# EasyEDA Pro project ESP32_RelayBoard.eprj

# Schematic ESP32_RelayControl
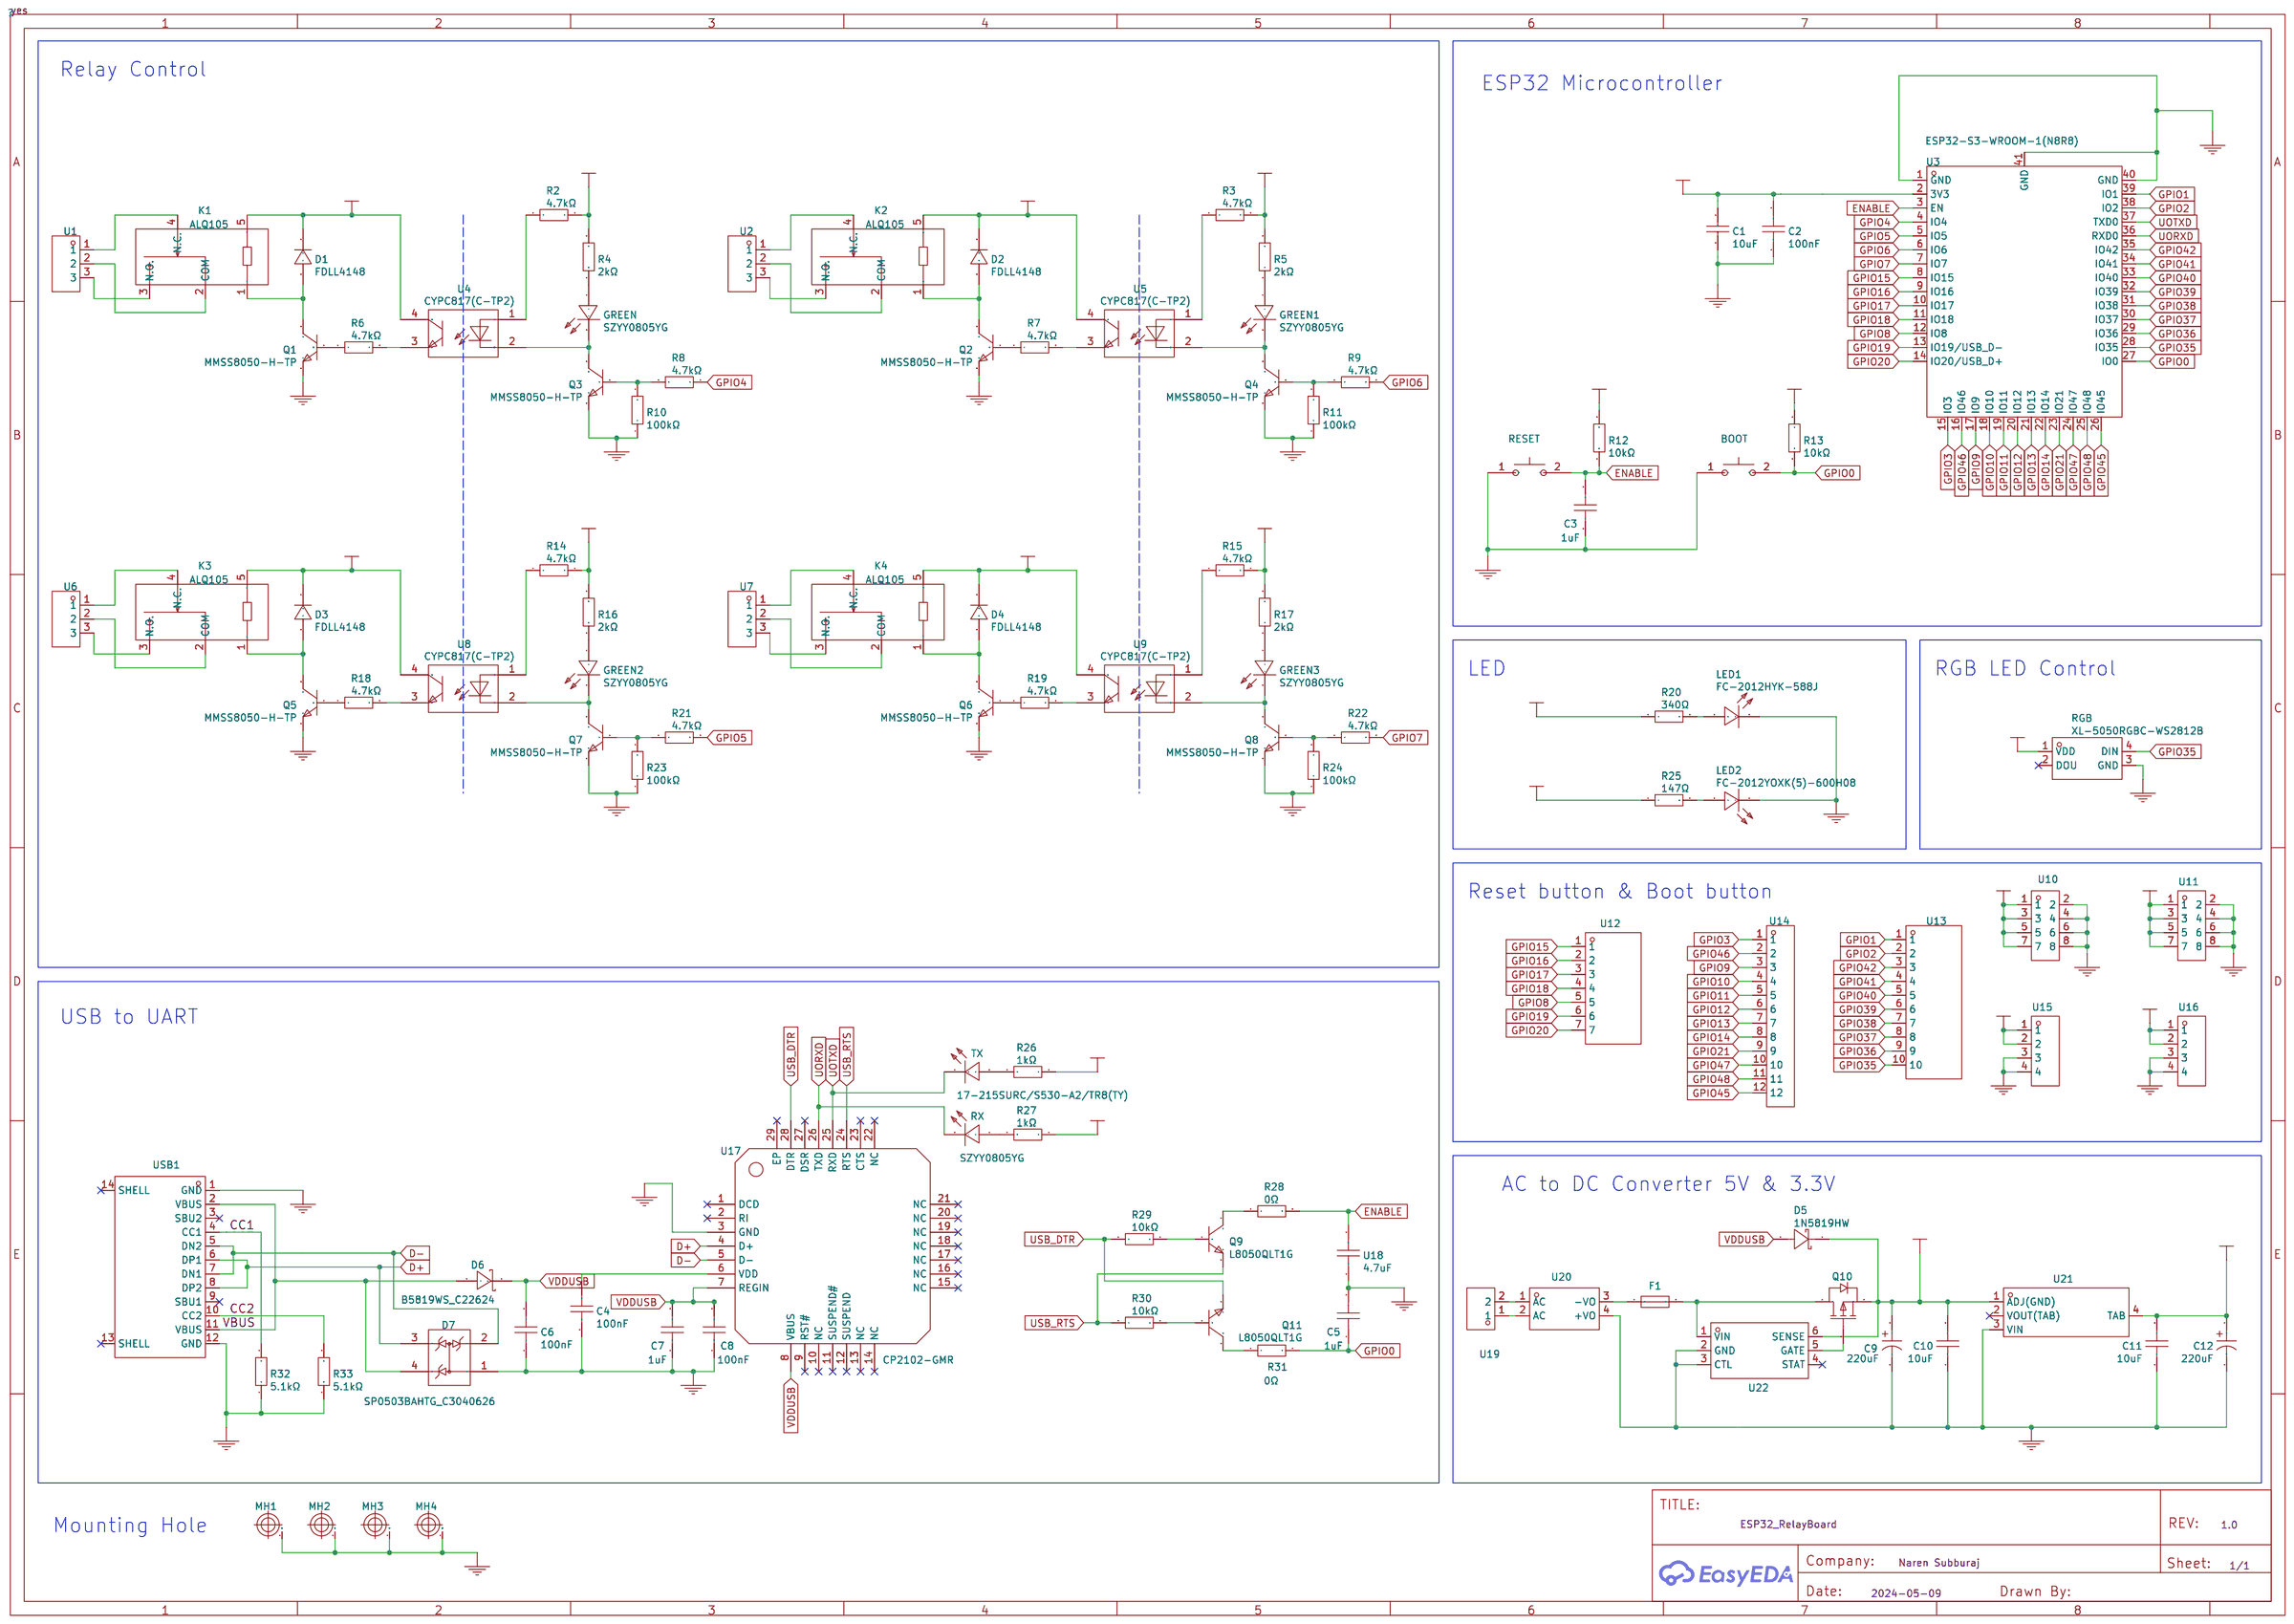
[diagram p0: schematic sheet]

## Parts
BOOT  TS-1101S-C-B-B-B-A  [SW-SMD_L6.0-W3.5-LS8.0]
C1  10uF  [C0402]
C2  100nF  [C0402]
C3  1uF  [C0402]
C4  100nF  [C0402]
C5  1uF  [C0402]
C6  100nF  [C0402]
C7  1uF  [C0402]
C8  100nF  [C0402]
C9  220uF  [CAP-SMD_BD6.3-L6.6-W6.6-LS7.2-FD]
C10  10uF  [C0805]
C11  10uF  [C0805]
C12  220uF  [CAP-SMD_BD6.3-L6.6-W6.6-LS7.2-FD]
D1  FDLL4148  [SOD-80_L3.5-W1.5-RD]
D2  FDLL4148  [SOD-80_L3.5-W1.5-RD]
D3  FDLL4148  [SOD-80_L3.5-W1.5-RD]
D4  FDLL4148  [SOD-80_L3.5-W1.5-RD]
D5  1N5819HW  [SOD-123_L2.7-W1.6-LS3.7-RD-1]
D6  B5819WS_C22624  [SOD-323_L1.8-W1.3-LS2.5-RD]
D7  SP0503BAHTG_C3040626  [SOT-143-4_L2.9-W1.3-P1.92-LS2.4-BL]
F1  BSMD0805-100-6V  [F0805]
GREEN  SZYY0805YG  [LED0805-R-RD_GREEN]
GREEN1  SZYY0805YG  [LED0805-R-RD_GREEN]
GREEN2  SZYY0805YG  [LED0805-R-RD_GREEN]
GREEN3  SZYY0805YG  [LED0805-R-RD_GREEN]
K1  ALQ105  [RELAY-TH_ALQ1XX]
K2  ALQ105  [RELAY-TH_ALQ1XX]
K3  ALQ105  [RELAY-TH_ALQ1XX]
K4  ALQ105  [RELAY-TH_ALQ1XX]
LED1  FC-2012HYK-588J  [LED0805-R-RD]
LED2  FC-2012YOXK(5)-600H08  [LED0805-RD_ORANGE]
MH1  M2-MOUNTING-HOLE  [M2-MOUNTING-HOLE]
MH2  M2-MOUNTING-HOLE  [M2-MOUNTING-HOLE]
MH3  M2-MOUNTING-HOLE  [M2-MOUNTING-HOLE]
MH4  M2-MOUNTING-HOLE  [M2-MOUNTING-HOLE]
Q1  MMSS8050-H-TP  [SOT-23-3_L2.9-W1.6-P1.90-LS2.8-BR]
Q2  MMSS8050-H-TP  [SOT-23-3_L2.9-W1.6-P1.90-LS2.8-BR]
Q3  MMSS8050-H-TP  [SOT-23-3_L2.9-W1.6-P1.90-LS2.8-BR]
Q4  MMSS8050-H-TP  [SOT-23-3_L2.9-W1.6-P1.90-LS2.8-BR]
Q5  MMSS8050-H-TP  [SOT-23-3_L2.9-W1.6-P1.90-LS2.8-BR]
Q6  MMSS8050-H-TP  [SOT-23-3_L2.9-W1.6-P1.90-LS2.8-BR]
Q7  MMSS8050-H-TP  [SOT-23-3_L2.9-W1.6-P1.90-LS2.8-BR]
Q8  MMSS8050-H-TP  [SOT-23-3_L2.9-W1.6-P1.90-LS2.8-BR]
Q9  L8050QLT1G  [SOT-23-3_L2.9-W1.3-P1.90-LS2.4-BR]
Q10  FDN306P  [SOT-23-3_L3.0-W1.7-P0.95-LS2.9-BR]
Q11  L8050QLT1G  [SOT-23-3_L2.9-W1.3-P1.90-LS2.4-BR]
R2  4.7kΩ  [R0805]
R3  4.7kΩ  [R0805]
R4  2kΩ  [R0805]
R5  2kΩ  [R0805]
R6  4.7kΩ  [R0805]
R7  4.7kΩ  [R0805]
R8  4.7kΩ  [R0805]
R9  4.7kΩ  [R0805]
R10  100kΩ  [R0805]
R11  100kΩ  [R0805]
R12  10kΩ  [R0402]
R13  10kΩ  [R0402]
R14  4.7kΩ  [R0805]
R15  4.7kΩ  [R0805]
R16  2kΩ  [R0805]
R17  2kΩ  [R0805]
R18  4.7kΩ  [R0805]
R19  4.7kΩ  [R0805]
R20  340Ω  [R0805]
R21  4.7kΩ  [R0805]
R22  4.7kΩ  [R0805]
R23  100kΩ  [R0805]
R24  100kΩ  [R0805]
R25  147Ω  [R0805]
R26  1kΩ  [R0805]
R27  1kΩ  [R0805]
R28  0Ω  [R0402]
R29  10kΩ  [R0402]
R30  10kΩ  [R0402]
R31  0Ω  [R0402]
R32  5.1kΩ  [R0402]
R33  5.1kΩ  [R0402]
RESET  TS-1101S-C-B-B-B-A  [SW-SMD_L6.0-W3.5-LS8.0]
RGB  XL-5050RGBC-WS2812B  [LED-SMD_4P-L5.0-W5.0-BL_XL-5050RGBC]
RX  SZYY0805YG  [LED0805-R-RD_GREEN]
TX  17-215SURC/S530-A2/TR8(TY)  [LED0805-RD_RED]
U1  DB128L-5.08-3P-BK-S  [CONN-TH_3P-P5.08_DB128L-5.08-3P-BK-S]
U2  DB128L-5.08-3P-BK-S  [CONN-TH_3P-P5.08_DB128L-5.08-3P-BK-S]
U3  ESP32-S3-WROOM-1(N8R8)  [WIRELM-SMD_ESP32-S3-WROOM-1]
U4  CYPC817(C-TP2)  [SOP-4_L6.4-W4.6-P2.54-LS10.2-TL]
U5  CYPC817(C-TP2)  [SOP-4_L6.4-W4.6-P2.54-LS10.2-TL]
U6  DB128L-5.08-3P-BK-S  [CONN-TH_3P-P5.08_DB128L-5.08-3P-BK-S]
U7  DB128L-5.08-3P-BK-S  [CONN-TH_3P-P5.08_DB128L-5.08-3P-BK-S]
U8  CYPC817(C-TP2)  [SOP-4_L6.4-W4.6-P2.54-LS10.2-TL]
U9  CYPC817(C-TP2)  [SOP-4_L6.4-W4.6-P2.54-LS10.2-TL]
U10  ZX-PM2.54-2-4PY  [HDR-TH_8P-P2.54-V-F-R2-C4-S2.54]
U11  ZX-PM2.54-2-4PY  [HDR-TH_8P-P2.54-V-F-R2-C4-S2.54]
U12  A2541HWV-7P  [HDR-TH_7P-P2.54-V_A2541HWV-7P]
U13  A2541HWV-10P  [HDR-TH_10P-P2.54-V-F-1]
U14  ZX-PM2.54-1-12PY  [HDR-TH_12P-P2.54-V-F]
U15  HB-PH3-25414PB2GOP  [HDR-TH_4P-P2.54-V-M]
U16  HB-PH3-25414PB2GOP  [HDR-TH_4P-P2.54-V-M]
U17  CP2102-GMR  [WQFN-28_L5.0-W5.0-P0.50-BL-EP3.2]
U18  4.7uF  [C0402]
U19  DB128L-5.08-2P-BK-S  [CONN-TH_2P-P5.08_DB128L-5.08-2P-BK-S]
U20  HLK-10M05  [PWRM-TH_HLK-10M05]
U21  AMS1117-3.3_C347222  [SOT-223-4_L6.5-W3.5-P2.30-LS7.0-BR]
U22  LTC4412HVIS6#TRPBF  [TSOT-23-6_L2.9-W1.6-P0.95-LS2.8-BR]
USB1  TYPE-C 16PIN 2MD(073)  [USB-C-SMD_TYPE-C-6PIN-2MD-073]

## Library data of the parts
BOOT RESET = TS-1101S-C-B-B-B-A: Supplier: LCSC; Supplier Part: C609852; Manufacturer: XKB Connectivity(中国星坤); JLCPCB Part Class: Extended Part
C1 = 10uF: Supplier: LCSC; Manufacturer: YAGEO(国巨); Manufacturer Part: CC0402MRX5R5BB106; Supplier Part: C105884; JLCPCB Part Class: Extended Part
C2 C4 C6 C8 = 100nF: Supplier: LCSC; Supplier Part: C3015120; Manufacturer: HRE(芯声); Manufacturer Part: CSA0402X7R104K250GT; JLCPCB Part Class: Extended Part
C3 C5 C7 = 1uF: Supplier: LCSC; Supplier Part: C7472948; Manufacturer: Chinocera(华瓷); Manufacturer Part: HGC0402R5105K500NTEJ; JLCPCB Part Class: Extended Part
C9 C12 = 220uF: Supplier: LCSC; Supplier Part: C2827940; Manufacturer: SAMYOUNG(韩国三莹); Manufacturer Part: MVG 16V 220UF 6.3*7.7; JLCPCB Part Class: Extended Part
C10 C11 = 10uF: Supplier: LCSC; Manufacturer: FH(风华); Manufacturer Part: 0805F106M160NT; Supplier Part: C90545; JLCPCB Part Class: Extended Part
D1-D4 = FDLL4148: Supplier: LCSC; Manufacturer: onsemi(安森美); Supplier Part: C78608; JLCPCB Part Class: Extended Part
D5 = 1N5819HW: Supplier: LCSC; Supplier Part: C2905649; Manufacturer: TECH PUBLIC(台舟); JLCPCB Part Class: Extended Part
D6 = B5819WS_C22624: Supplier: LCSC; Manufacturer Part: B5819WS; Manufacturer: CJ(江苏长电/长晶); Supplier Part: C22624; JLCPCB Part Class: Extended Part
D7 = SP0503BAHTG_C3040626: Supplier: LCSC; Supplier Part: C3040626; Manufacturer: TECH PUBLIC(台舟); Manufacturer Part: SP0503BAHTG; JLCPCB Part Class: Extended Part
F1 = BSMD0805-100-6V: Supplier: LCSC; Supplier Part: C883112; Manufacturer: BHFUSE(佰宏); JLCPCB Part Class: Extended Part
GREEN GREEN1-GREEN3 RX = SZYY0805YG: Supplier: LCSC; Supplier Part: C434435; Manufacturer: yongyu(永裕光电); JLCPCB Part Class: Extended Part
K1-K4 = ALQ105: Supplier: LCSC; Supplier Part: C719517; Manufacturer: PANASONIC(松下); JLCPCB Part Class: Extended Part
LED1 = FC-2012HYK-588J: Supplier: LCSC; Manufacturer: 国星光电; Manufacturer Part: NCD0805Y1; Supplier Part: C84261; JLCPCB Part Class: Extended Part
LED2 = FC-2012YOXK(5)-600H08: Supplier: LCSC; Manufacturer: 国星光电; Manufacturer Part: NCD0805O1; Supplier Part: C84262; JLCPCB Part Class: Extended Part
MH1-MH4 = M2-MOUNTING-HOLE
Q1-Q8 = MMSS8050-H-TP: Supplier: LCSC; Manufacturer: MCC(美微科); Supplier Part: C90158; JLCPCB Part Class: Extended Part
Q9 Q11 = L8050QLT1G: Supplier: LCSC; Manufacturer: LRC(乐山无线电); Supplier Part: C49581; JLCPCB Part Class: Extended Part
Q10 = FDN306P: Supplier: LCSC; Supplier Part: C154510; Manufacturer: onsemi(安森美); JLCPCB Part Class: Extended Part
R2 R3 R6-R9 R14 R15 R18 R19 R21 R22 = 4.7kΩ: Supplier: LCSC; Manufacturer: UNI-ROYAL(厚声); Manufacturer Part: 0805W8F4701T5E; Supplier Part: C17673; JLCPCB Part Class: Basic Part
R4 R5 R16 R17 = 2kΩ: Supplier: LCSC; Manufacturer: UNI-ROYAL(厚声); Manufacturer Part: 0805W8F2001T5E; Supplier Part: C17604; JLCPCB Part Class: Basic Part
R10 R11 R23 R24 = 100kΩ: Supplier: LCSC; Supplier Part: C149504; Manufacturer: UNI-ROYAL(厚声); Manufacturer Part: 0805W8F1003T5E; JLCPCB Part Class: Basic Part
R12 R13 R29 R30 = 10kΩ: Supplier: LCSC; Supplier Part: C326912; Manufacturer: YAGEO(国巨); Manufacturer Part: RT0402DRE0710KL; JLCPCB Part Class: Extended Part
R20 = 340Ω: Supplier: LCSC; Supplier Part: C101671; Manufacturer: LIZ(丽智电子); Manufacturer Part: CR0805F83400G; JLCPCB Part Class: Extended Part
R25 = 147Ω: Supplier: LCSC; Supplier Part: C203753; Manufacturer: BOURNS; Manufacturer Part: CR0805-FX-1470ELF; JLCPCB Part Class: Extended Part
R26 R27 = 1kΩ: Supplier: LCSC; Supplier Part: C269727; Manufacturer: Tyohm(幸亚电阻); Manufacturer Part: RMC08051K5%N; JLCPCB Part Class: Extended Part
R28 R31 = 0Ω: Supplier: LCSC; Manufacturer: YAGEO(国巨); Manufacturer Part: RC0402FR-070RL; Supplier Part: C106231; JLCPCB Part Class: Extended Part
R32 R33 = 5.1kΩ: Supplier: LCSC; Supplier Part: C325521; Manufacturer: Tyohm(幸亚电阻); Manufacturer Part: RMC04025.1K1%N; JLCPCB Part Class: Extended Part
RGB = XL-5050RGBC-WS2812B: Supplier: LCSC; Supplier Part: C2843785; Manufacturer: XINGLIGHT(成兴光); JLCPCB Part Class: Extended Part
TX = 17-215SURC/S530-A2/TR8(TY): Supplier: LCSC; Manufacturer: EVERLIGHT(亿光); Manufacturer Part: 17-215SURC/S530-A2/TR8; Supplier Part: C142306; JLCPCB Part Class: Extended Part
U1 U2 U6 U7 = DB128L-5.08-3P-BK-S: Supplier: LCSC; Supplier Part: C430602; Manufacturer: DORABO(地博电气); JLCPCB Part Class: Extended Part
U3 = ESP32-S3-WROOM-1(N8R8): Supplier: LCSC; Supplier Part: C2913201; Manufacturer: ESPRESSIF(乐鑫); Manufacturer Part: ESP32-S3-WROOM-1-N8R8; JLCPCB Part Class: Extended Part
U4 U5 U8 U9 = CYPC817(C-TP2): Supplier: LCSC; Supplier Part: C385058; Manufacturer: OCIC(卓睿科); JLCPCB Part Class: Extended Part
U10 U11 = ZX-PM2.54-2-4PY: Supplier: LCSC; Supplier Part: C7499340; Manufacturer: Megastar(兆星); JLCPCB Part Class: Extended Part
U12 = A2541HWV-7P: Supplier: LCSC; Supplier Part: C225504; Manufacturer: CJT(长江连接器); JLCPCB Part Class: Extended Part
U13 = A2541HWV-10P: Supplier: LCSC; Supplier Part: C225507; Manufacturer: CJT(长江连接器); JLCPCB Part Class: Extended Part
U14 = ZX-PM2.54-1-12PY: Supplier: LCSC; Supplier Part: C7499331; Manufacturer: Megastar(兆星)
U15 U16 = HB-PH3-25414PB2GOP: Supplier: LCSC; Supplier Part: C6332197; Manufacturer: HANBO(汉博); JLCPCB Part Class: Extended Part
U17 = CP2102-GMR: Supplier: LCSC; Manufacturer: SKYWORKS/SILICON LABS(芯科); Supplier Part: C6568; JLCPCB Part Class: Extended Part
U18 = 4.7uF: Supplier: LCSC; Supplier Part: C7472956; Manufacturer: Chinocera(华瓷); Manufacturer Part: HGC0402R5475K100NTEJ; JLCPCB Part Class: Extended Part
U19 = DB128L-5.08-2P-BK-S: Supplier: LCSC; Supplier Part: C430601; Manufacturer: DORABO(地博电气); JLCPCB Part Class: Extended Part
U20 = HLK-10M05: Supplier: LCSC; Supplier Part: C403745; Manufacturer: HI-LINK(海凌科); JLCPCB Part Class: Extended Part
U21 = AMS1117-3.3_C347222: Supplier: LCSC; Supplier Part: C347222; Manufacturer: UMW(友台半导体); Manufacturer Part: AMS1117-3.3; JLCPCB Part Class: Extended Part
U22 = LTC4412HVIS6#TRPBF: Supplier: LCSC; Supplier Part: C462626; Manufacturer: ADI(亚德诺); JLCPCB Part Class: Extended Part
USB1 = TYPE-C 16PIN 2MD(073): Supplier: LCSC; Supplier Part: C2765186; Manufacturer: SHOU HAN(首韩); JLCPCB Part Class: Extended Part

## Nets
3V3: C1.2 C2.2 C11.2 C12.1 R2.2 R3.2 R4.2 R5.2 R12.2 R13.2 R14.2 R15.2 R16.2 R17.2 R25.1 R26.1 R27.1 U3.2(3V3) U10.1 U10.3 U10.5 U10.7 U15.1 U15.2 U21.4(TAB)
+5V: C9.1 C10.2 D1.1(C) D2.1(C) D3.1(C) D4.1(C) D5.1(K) K1.5 K2.5 K3.5 K4.5 Q10.2(S) R20.1 RGB.1(VDD) U4.4(COL) U5.4(COL) U8.4(COL) U9.4(COL) U11.1 U11.3 U11.5 U11.7 U16.1 U16.2 U21.1(ADJ(GND)) U22.6(SENSE)
GND: BOOT.1 C1.1 C2.1 C3.1 C4.1 C5.2 C6.1 C7.1 C8.1 C9.2 C10.1 C11.1 C12.2 D7.1 LED1.2(K) LED2.1(-) MH1.1(GND) MH2.1(GND) MH3.1(GND) MH4.1(GND) Q1.2(E) Q2.2(E) Q3.2(E) Q4.2(E) Q5.2(E) Q6.2(E) Q7.2(E) Q8.2(E) R10.1 R11.1 R23.1 R24.1 R32.1 R33.1 RESET.1 RGB.3(GND) U3.1(GND) U3.40(GND) U3.41(GND) U10.2 U10.4 U10.6 U10.8 U11.2 U11.4 U11.6 U11.8 U15.3 U15.4 U16.3 U16.4 U17.3(GND) U18.1 U20.4(+VO) U21.3(VIN) U22.2(GND) U22.3(CTL) USB1.1(GND) USB1.12(GND)
VBUS: D6.2(A) D7.4 USB1.2(VBUS) USB1.11(VBUS)
VDDUSB: C6.2 C7.2 C8.2 D5.2(A) D6.1(K) U17.7(REGIN) U17.8(VBUS)
CC1: R32.2 USB1.4(CC1)
CC2: R33.2 USB1.10(CC2)
D+: D7.3 U17.4(D+) USB1.6(DP1) USB1.8(DP2)
D-: D7.2 U17.5(D-) USB1.5(DN2) USB1.7(DN1)
ENABLE: C3.2 R12.1 R28.2 RESET.2 U3.3(EN) U18.2
GPIO0: BOOT.2 C5.1 R13.1 R31.2 U3.27(IO0)
GPIO1: U3.39(IO1) U13.1
GPIO2: U3.38(IO2) U13.2
GPIO3: U3.15(IO3) U14.1
GPIO4: R8.2 U3.4(IO4)
GPIO5: R21.2 U3.5(IO5)
GPIO6: R9.2 U3.6(IO6)
GPIO7: R22.2 U3.7(IO7)
GPIO8: U3.12(IO8) U12.5
GPIO9: U3.17(IO9) U14.3
GPIO10: U3.18(IO10) U14.4
GPIO11: U3.19(IO11) U14.5
GPIO12: U3.20(IO12) U14.6
GPIO13: U3.21(IO13) U14.7
GPIO14: U3.22(IO14) U14.8
GPIO15: U3.8(IO15) U12.1
GPIO16: U3.9(IO16) U12.2
GPIO17: U3.10(IO17) U12.3
GPIO18: U3.11(IO18) U12.4
GPIO19: U3.13(IO19/USB_D-) U12.6
GPIO20: U3.14(IO20/USB_D+) U12.7
GPIO21: U3.23(IO21) U14.9
GPIO35: RGB.4(DIN) U3.28(IO35) U13.10
GPIO36: U3.29(IO36) U13.9
GPIO37: U3.30(IO37) U13.8
GPIO38: U3.31(IO38) U13.7
GPIO39: U3.32(IO39) U13.6
GPIO40: U3.33(IO40) U13.5
GPIO41: U3.34(IO41) U13.4
GPIO42: U3.35(IO42) U13.3
GPIO45: U3.26(IO45) U14.12
GPIO46: U3.16(IO46) U14.2
GPIO47: U3.24(IO47) U14.10
GPIO48: U3.25(IO48) U14.11
UORXD: RX.2(-) U3.36(RXD0) U17.26(TXD)
UOTXD: TX.1(K) U3.37(TXD0) U17.25(RXD)
USB_DTR: Q11.2(E) R29.1 U17.28(DTR)
USB_RTS: Q9.2(E) R30.1 U17.24(RTS)
D2_2: D2.2(A) K2.1 Q2.3(C)
D3_2: D3.2(A) K3.1 Q5.3(C)
GREEN1_1: GREEN1.1(+) R5.1
GREEN1_2: GREEN1.2(-) Q4.3(C) U5.2(CAT)
GREEN2_1: GREEN2.1(+) R16.1
GREEN2_2: GREEN2.2(-) Q7.3(C) U8.2(CAT)
K1_1: D1.2(A) K1.1 Q1.3(C)
K1_2: K1.2(COM) U1.2
K1_3: K1.3(N.O.) U1.3
K1_4: K1.4(N.C.) U1.1
K2_2: K2.2(COM) U2.2
K2_3: K2.3(N.O.) U2.3
K2_4: K2.4(N.C.) U2.1
K3_2: K3.2(COM) U6.2
K3_3: K3.3(N.O.) U6.3
K3_4: K3.4(N.C.) U6.1
K4_1: D4.2(A) K4.1 Q6.3(C)
K4_2: K4.2(COM) U7.2
K4_3: K4.3(N.O.) U7.3
K4_4: K4.4(N.C.) U7.1
LED2_2: LED2.2(+) R25.2
Q1_1: Q1.1(B) R6.1
Q3_1: Q3.1(B) R8.1 R10.2
Q6_1: Q6.1(B) R19.1
Q8_1: Q8.1(B) R22.1 R24.2
Q9_1: Q9.1(B) R29.2
Q9_3: Q9.3(C) R28.1
Q11_1: Q11.1(B) R30.2
Q11_3: Q11.3(C) R31.1
R3_1: R3.1 U5.1(AN)
R4_1: GREEN.1(+) R4.1
R7_1: Q2.1(B) R7.1
R7_2: R7.2 U5.3(EMI)
R11_2: Q4.1(B) R9.1 R11.2
R14_1: R14.1 U8.1(AN)
R17_1: GREEN3.1(+) R17.1
R18_1: Q5.1(B) R18.1
R18_2: R18.2 U8.3(EMI)
R20_2: LED1.1(A) R20.2
R23_2: Q7.1(B) R21.1 R23.2
RX_1: R27.2 RX.1(+)
TX_2: R26.2 TX.2(A)
U4_1: R2.1 U4.1(AN)
U4_2: GREEN.2(-) Q3.3(C) U4.2(CAT)
U4_3: R6.2 U4.3(EMI)
U9_1: R15.1 U9.1(AN)
U9_2: GREEN3.2(-) Q8.3(C) U9.2(CAT)
U9_3: R19.2 U9.3(EMI)
U17_6: C4.2 U17.6(VDD)
U19_1: U19.1 U20.2(AC)
U19_2: U19.2 U20.1(AC)
U20_3: F1.1 U20.3(-VO)
U22_1: F1.2 Q10.3(D) U22.1(VIN)
U22_5: Q10.1(G) U22.5(GATE)

Not connected (* = marked no-connect by the designer): RGB 2(DOU)*; U17 1(DCD)* 2(RI)* 9(RST#)* 10(NC)* 11(SUSPEND#)* 12(SUSPEND)* 13(NC)* 14(NC)* 15(NC)* 16(NC)* 17(NC)* 18(NC)* 19(NC)* 20(NC)* 21(NC)* 22(NC)* 23(CTS)* 27(DSR)* 29(EP)*; U21 2(VOUT(TAB))*; U22 4(STAT)*; USB1 3(SBU2)* 9(SBU1)* 13(SHELL)* 14(SHELL)*

## Notes on the sheet
- Relay Control
- ESP32 Microcontroller
- LED
- RGB LED Control
- Reset button & Boot button
- USB to UART
- AC to DC Converter 5V & 3.3V
- Mounting Hole

# Board PCB_ESP32_RelayControl
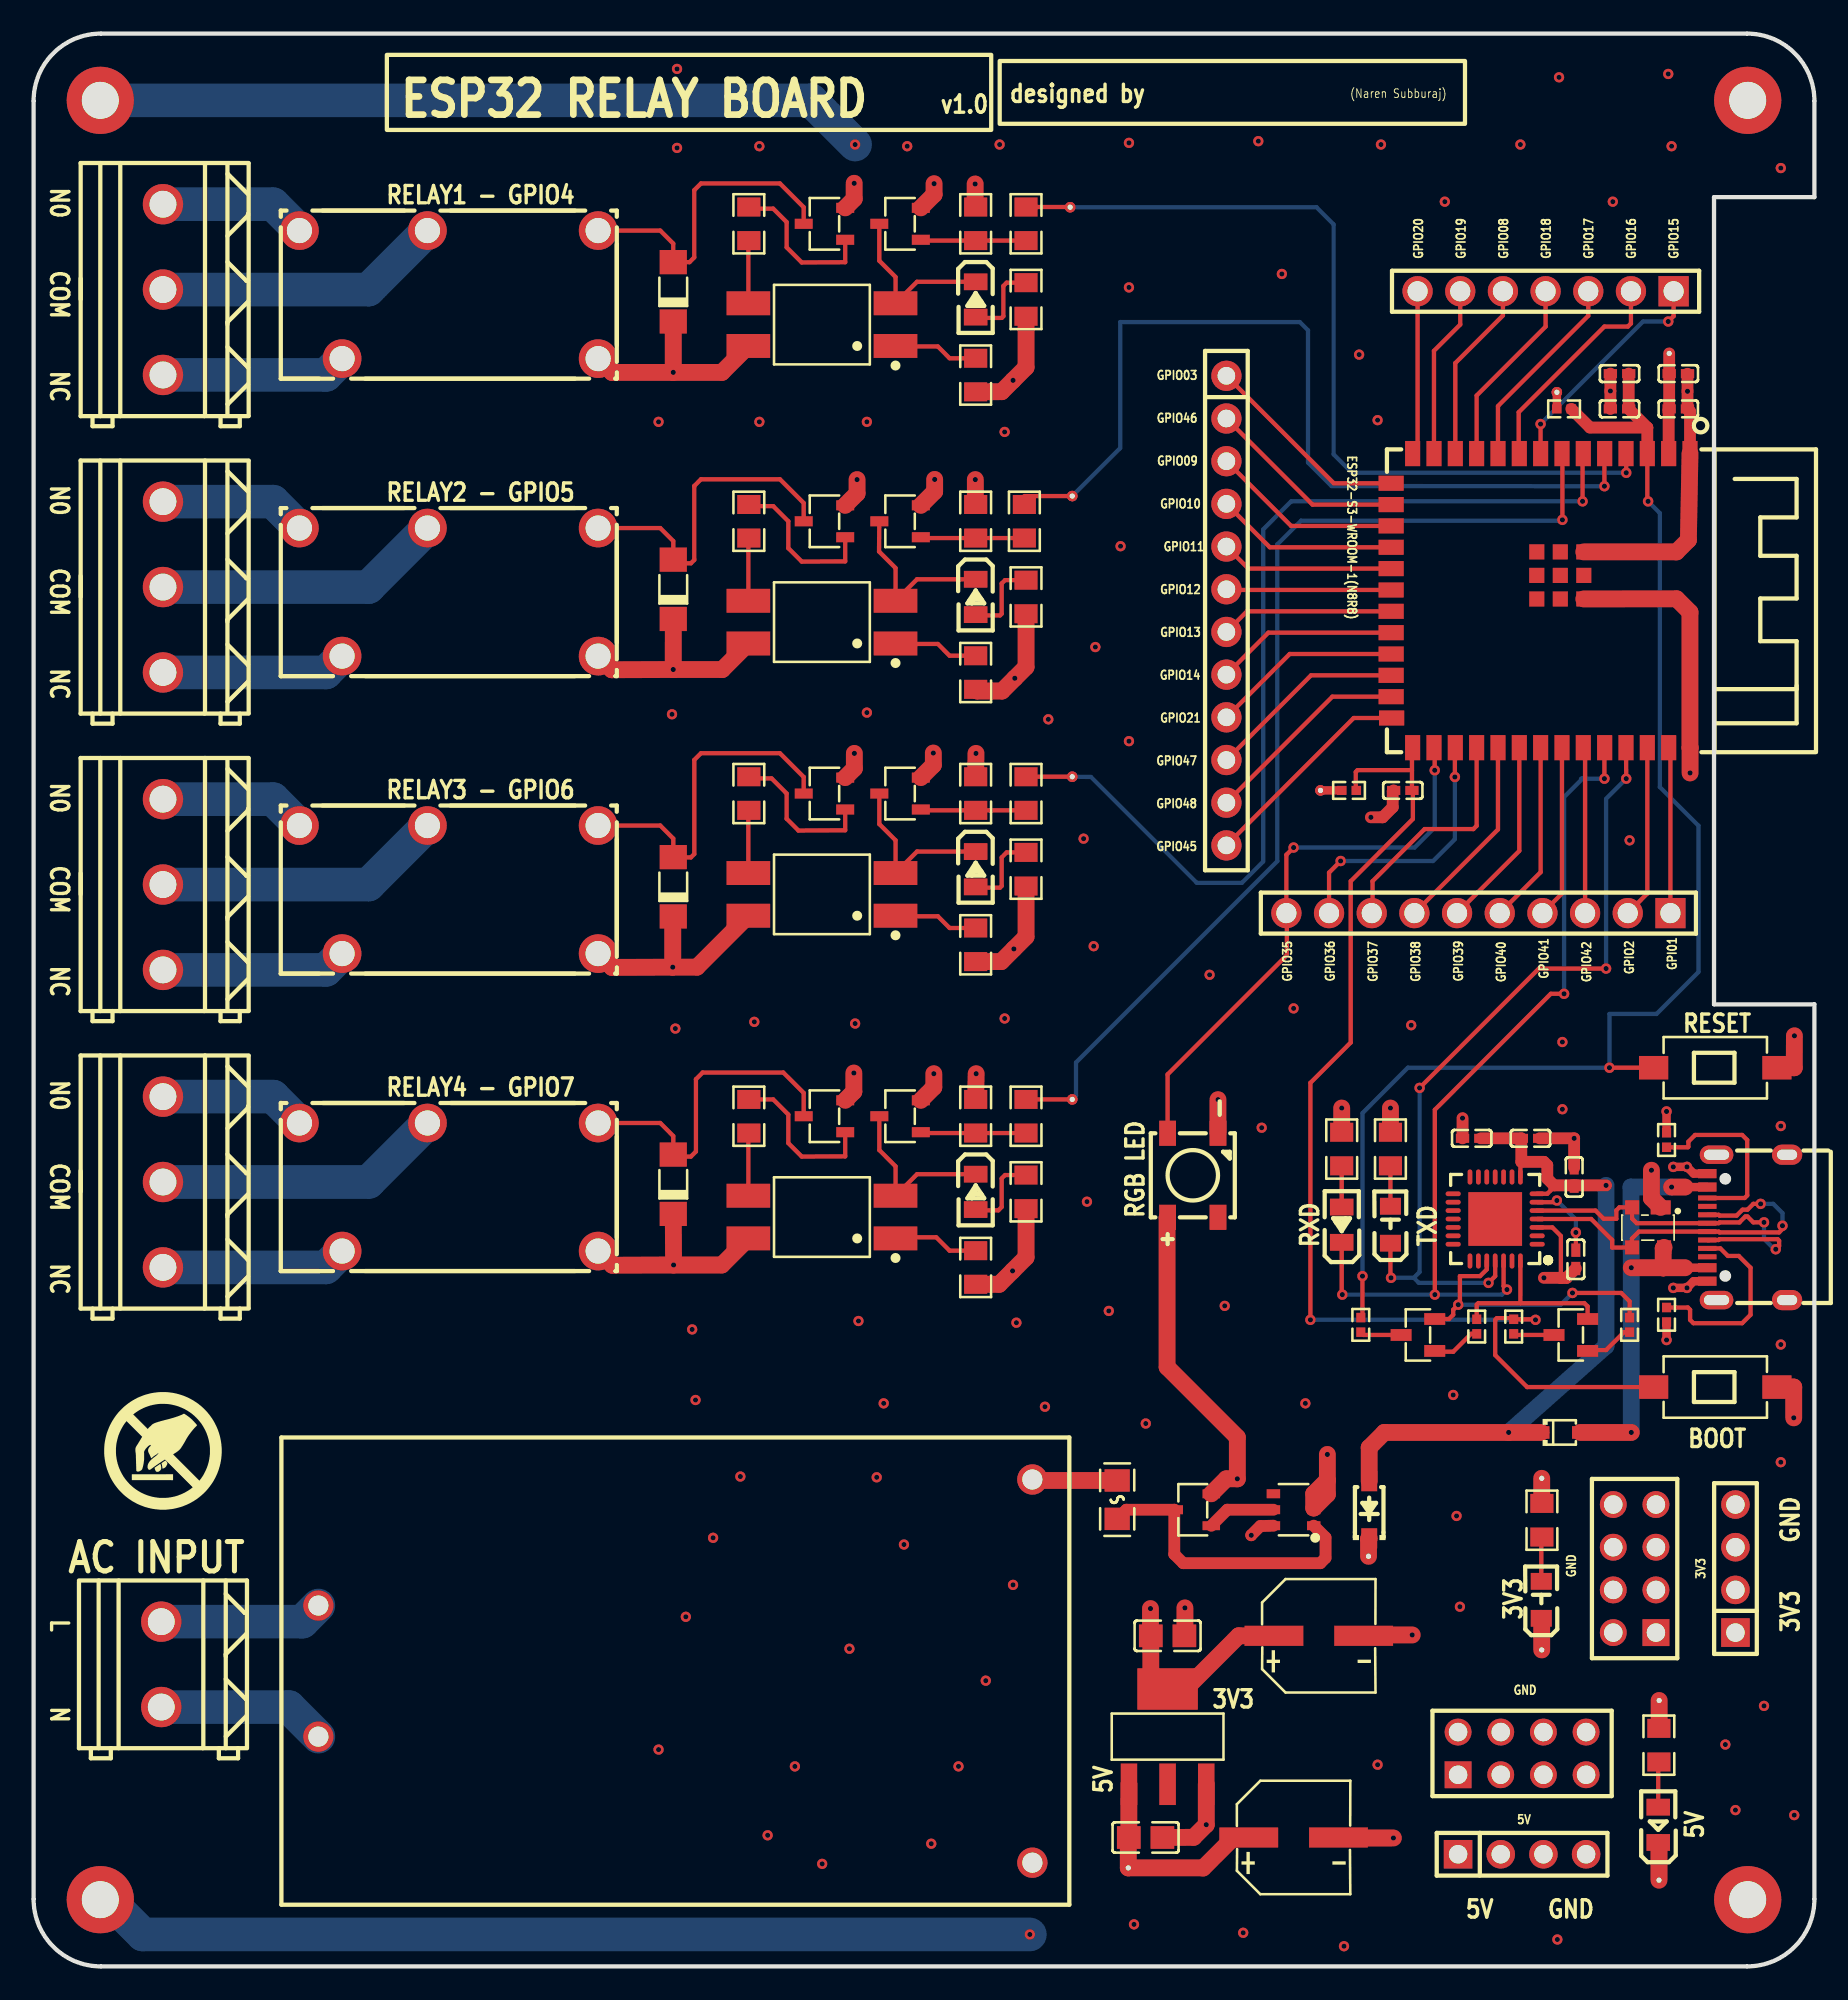
[diagram p1: board, top side]
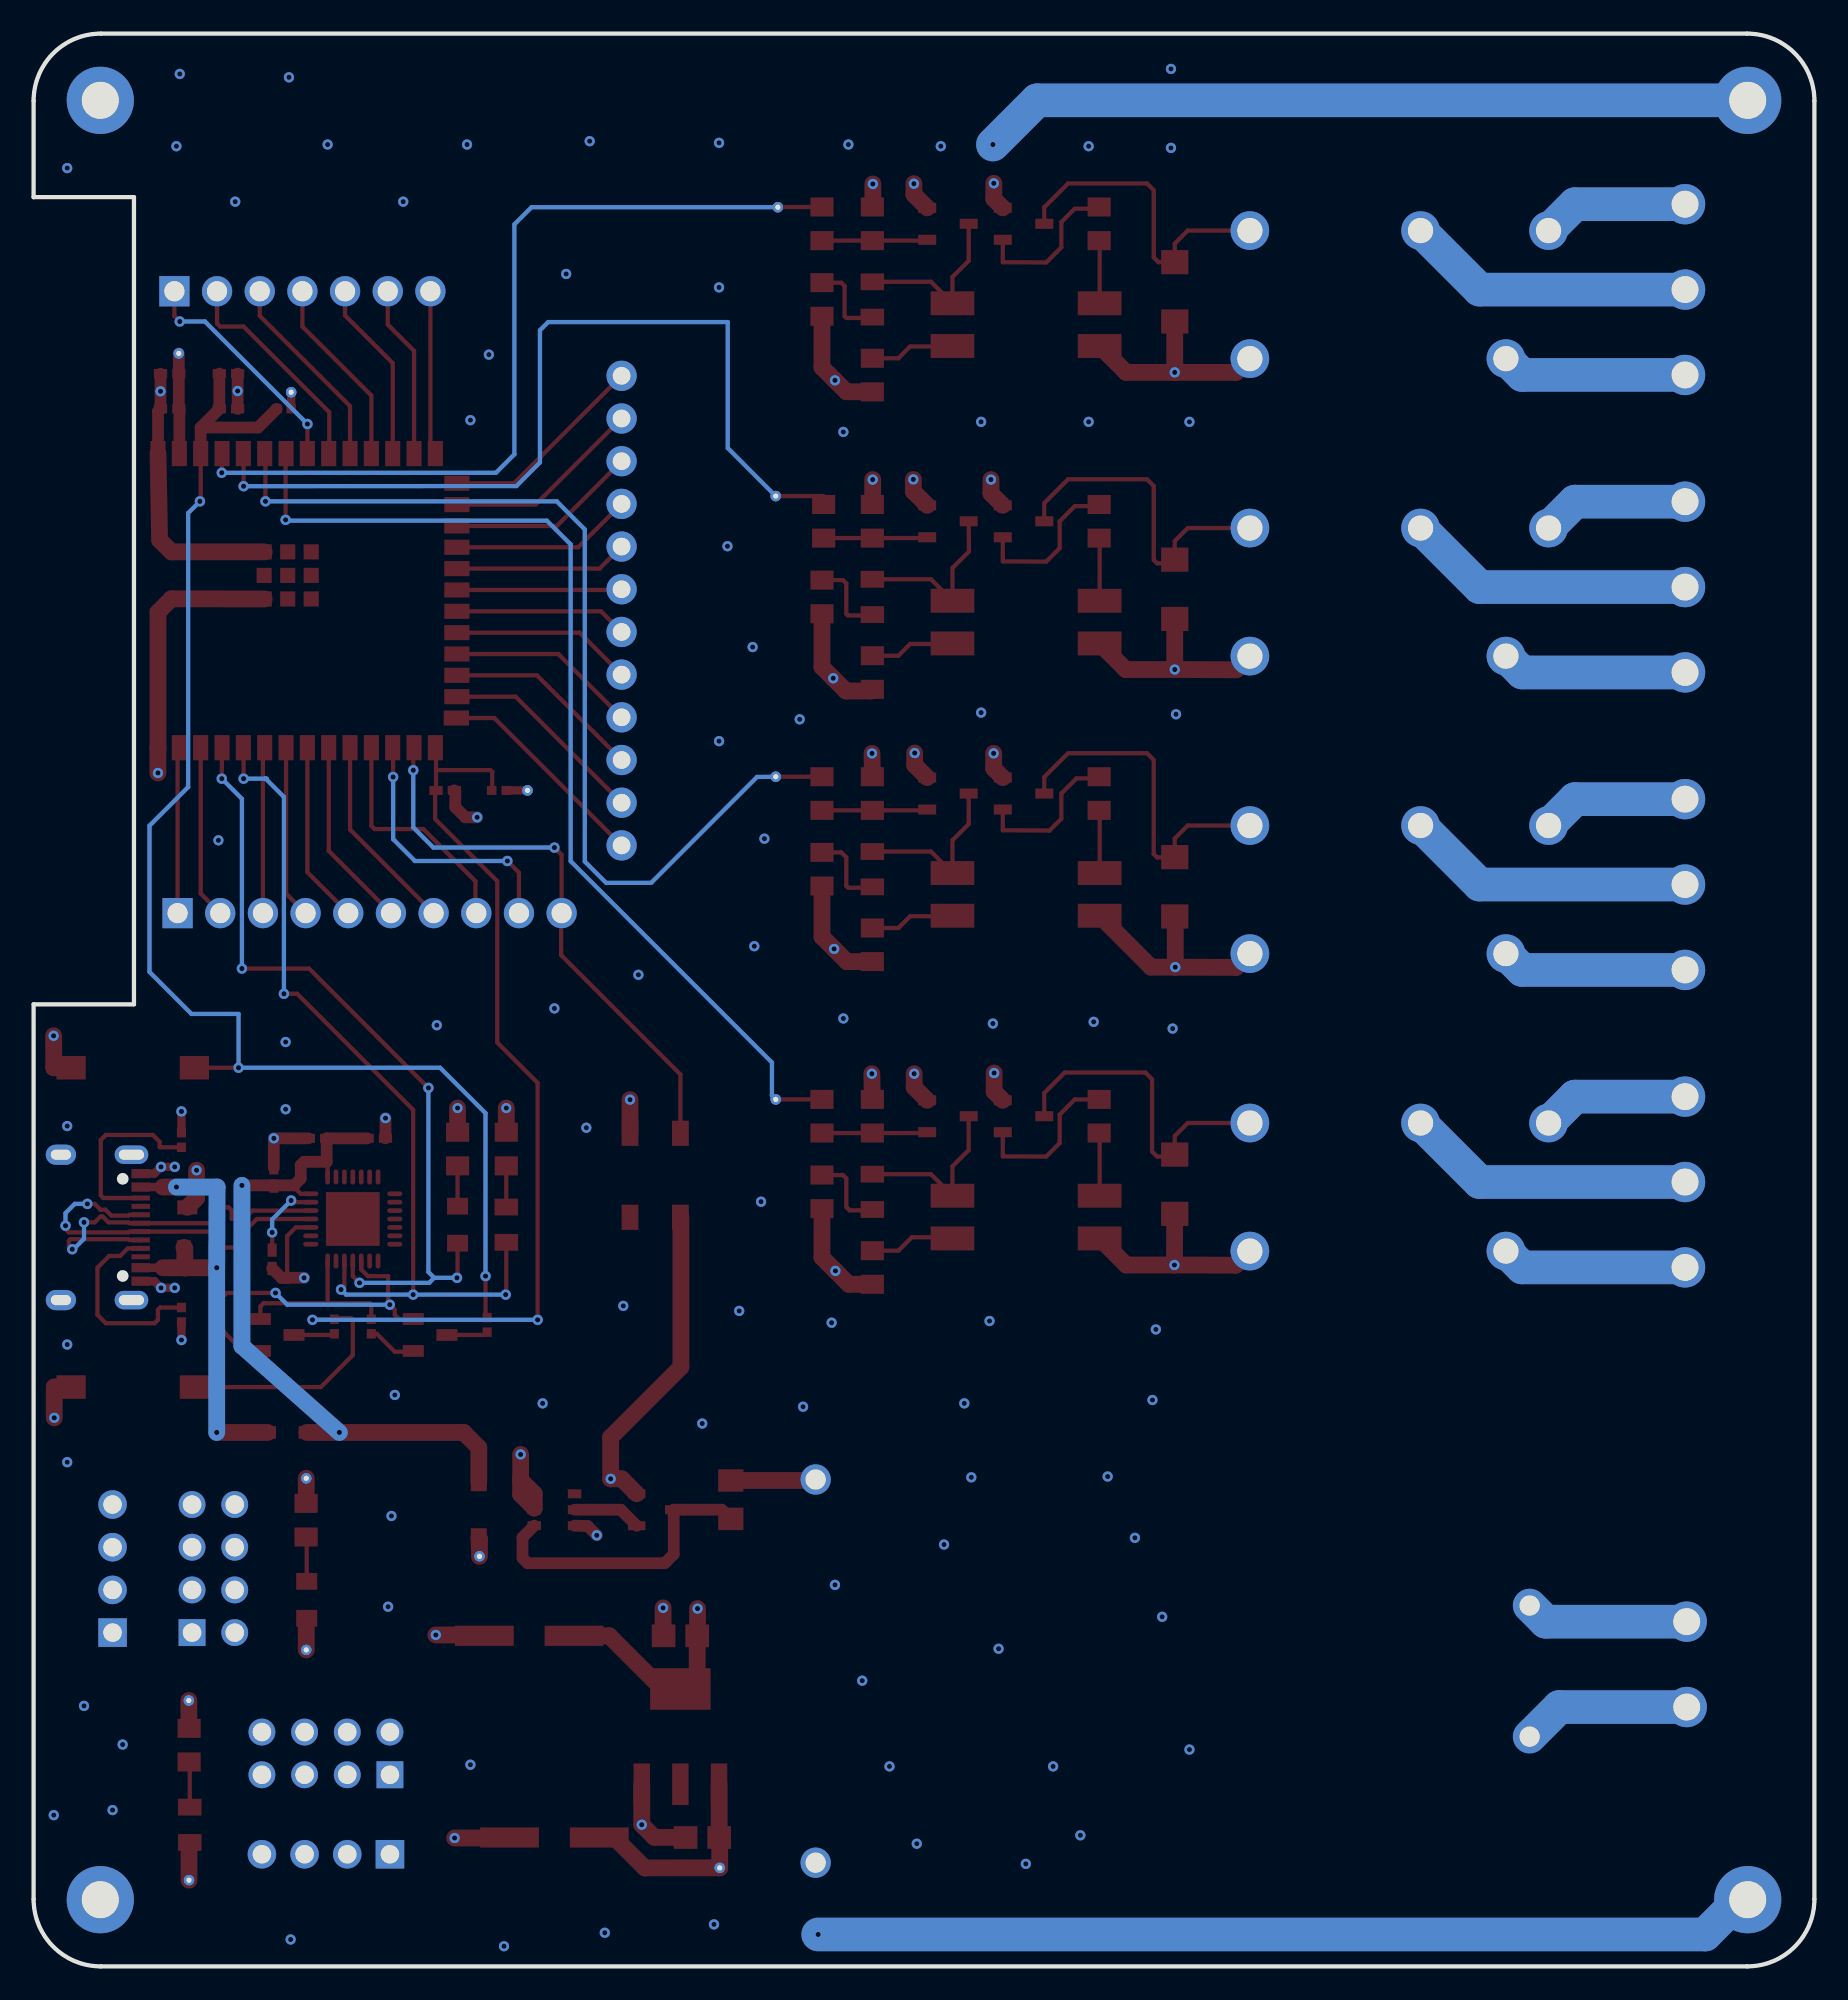
[diagram p2: board, bottom side, seen from below]

Outline 106 x 115 mm; copper layers: Top Layer, GND, Power, Bottom Layer. Coordinates in mm from the lower left corner of the outline.
Outline path: 0,111 0,4 arc(1.17,1.17) 4,0 102,0 arc(104.83,1.17) 106,4 106,57.24 100.03,57.24 100.03,105.27 106,105.27 106,111 arc(104.83,113.83) 102,115 4,115 arc(1.17,113.83) 0,111
Stack: Top Layer 0.035mm / Dielectric1 0.48mm PP er 4.5 / GND 0.035mm / Dielectric2 0.48mm FR4 er 4.5 / Power 0.035mm / Dielectric3 0.48mm PP er 4.5 / Bottom Layer 0.035mm

## Design rules (mm)
net D-: DP1
net D+: DP1
template: User Custom Config
spacing Default (default): track to track 0.152, other pairs 0 to 0.152
track width Default (default): min 0.254, default 0.254, max 25.4
differential pair differentialPair (default): width min 0.127, default 0.254, max 2.54; gap min 0.152, default 0.152
via Default (default): diameter min 0.61, default 0.61, max 100.025; hole min 0.305, default 0.305, max 59.995
net 3V3 uses gge71533
net GND uses gge81540
pour e108 uses gge71440
pour e694 uses gge81540

## Placement (name value [footprint] x y rotation side)
BOOT  TS-1101S-C-B-B-B-A  [SW-SMD_L6.0-W3.5-LS8.0]  100.1 34.47 180 top
C1  10uF  [C0402]  97.9 94.77 180 top
C2  100nF  [C0402]  97.9 92.67 180 top
C3  1uF  [C0402]  94.4 92.67 0 top
C4  100nF  [C0402]  91.8 42.07 90 top
C5  1uF  [C0402]  81.5 69.97 180 top
C6  100nF  [C0402]  91.7 46.97 270 top
C7  1uF  [C0402]  85.6 49.27 0 top
C8  100nF  [C0402]  89.1 49.27 180 top
C9  220uF  [CAP-SMD_BD6.3-L6.6-W6.6-LS7.2-FD]  75 7.67 0 top
C10  10uF  [C0805]  66.19 7.67 180 top
C11  10uF  [C0805]  67.5 19.67 180 top
C12  220uF  [CAP-SMD_BD6.3-L6.6-W6.6-LS7.2-FD]  76.5 19.67 0 top
D1  FDLL4148  [SOD-80_L3.5-W1.5-RD]  38.07 99.64 90 top
D2  FDLL4148  [SOD-80_L3.5-W1.5-RD]  38.08 64.24 90 top
D3  FDLL4148  [SOD-80_L3.5-W1.5-RD]  38.08 81.94 90 top
D4  FDLL4148  [SOD-80_L3.5-W1.5-RD]  38.08 46.54 90 top
D5  1N5819HW  [SOD-123_L2.7-W1.6-LS3.7-RD-1]  79.5 27.17 90 top
D6  B5819WS_C22624  [SOD-323_L1.8-W1.3-LS2.5-RD]  90.9 31.77 0 top
D7  SP0503BAHTG_C3040626  [SOT-143-4_L2.9-W1.3-P1.92-LS2.4-BL]  96.1 43.97 180 top
F1  BSMD0805-100-6V  [F0805]  64.5 27.77 270 top
GREEN  SZYY0805YG  [LED0805-R-RD_GREEN]  56.07 99.18 270 top
GREEN1  SZYY0805YG  [LED0805-R-RD_GREEN]  56.07 65.28 270 top
GREEN2  SZYY0805YG  [LED0805-R-RD_GREEN]  56.07 81.48 270 top
GREEN3  SZYY0805YG  [LED0805-R-RD_GREEN]  56.08 46.08 270 top
K1  ALQ105  [RELAY-TH_ALQ1XX]  24.71 99.47 180 top
K2  ALQ105  [RELAY-TH_ALQ1XX]  24.71 64.07 180 top
K3  ALQ105  [RELAY-TH_ALQ1XX]  24.71 81.77 180 top
K4  ALQ105  [RELAY-TH_ALQ1XX]  24.71 46.37 180 top
LED1  FC-2012HYK-588J  [LED0805-R-RD]  96.7 8.42 90 top
LED2  FC-2012YOXK(5)-600H08  [LED0805-RD_ORANGE]  89.74 21.81 90 top
MH1  -  [M2-MOUNTING-HOLE]  102.03 3.97 0 top
MH2  -  [M2-MOUNTING-HOLE]  3.97 111.03 0 top
MH3  -  [M2-MOUNTING-HOLE]  102.03 111.03 0 top
MH4  -  [M2-MOUNTING-HOLE]  3.97 3.97 0 top
NOREF  -  [Pad_e2272]  97.36 95.97 0 top
NOREF#2  -  [Pad_e2269]  76.6 69.97 0 top
NOREF#3  -  [Pad_e2266]  61.82 87.48 0 top
NOREF#4  -  [Pad_e2267]  61.7 104.67 0 top
NOREF#5  -  [Pad_e2262]  89.77 29.04 0 top
NOREF#6  -  [Pad_e2261]  89.77 18.83 0 top
NOREF#7  -  [Pad_e2264]  61.82 51.58 0 top
NOREF#8  -  [Pad_e2263]  79.46 24.4 0 top
NOREF#9  -  [Pad_e2259]  96.75 5.13 0 top
NOREF#10  -  [Pad_e2265]  61.82 70.78 0 top
NOREF#11  -  [Pad_e2273]  90.67 93.66 0 top
NOREF#12  -  [Pad_e2260]  96.76 15.82 0 top
NOREF#13  -  [Pad_e2271]  65.16 5.86 0 top
Q1  MMSS8050-H-TP  [SOT-23-3_L2.9-W1.6-P1.90-LS2.8-BR]  47.07 103.68 0 top
Q2  MMSS8050-H-TP  [SOT-23-3_L2.9-W1.6-P1.90-LS2.8-BR]  47.07 69.78 0 top
Q3  MMSS8050-H-TP  [SOT-23-3_L2.9-W1.6-P1.90-LS2.8-BR]  51.57 103.68 0 top
Q4  MMSS8050-H-TP  [SOT-23-3_L2.9-W1.6-P1.90-LS2.8-BR]  51.58 69.78 0 top
Q5  MMSS8050-H-TP  [SOT-23-3_L2.9-W1.6-P1.90-LS2.8-BR]  47.07 85.98 0 top
Q6  MMSS8050-H-TP  [SOT-23-3_L2.9-W1.6-P1.90-LS2.8-BR]  47.08 50.58 0 top
Q7  MMSS8050-H-TP  [SOT-23-3_L2.9-W1.6-P1.90-LS2.8-BR]  51.58 85.98 0 top
Q8  MMSS8050-H-TP  [SOT-23-3_L2.9-W1.6-P1.90-LS2.8-BR]  51.58 50.58 0 top
Q9  L8050QLT1G  [SOT-23-3_L2.9-W1.3-P1.90-LS2.4-BR]  82.4 37.57 0 top
Q10  FDN306P  [SOT-23-3_L3.0-W1.7-P0.95-LS2.9-BR]  69 27.17 0 top
Q11  L8050QLT1G  [SOT-23-3_L2.9-W1.3-P1.90-LS2.4-BR]  91.5 37.57 0 top
R2  4.7kΩ  [R0805]  56.07 94.68 270 top
R3  4.7kΩ  [R0805]  56.07 60.78 270 top
R4  2kΩ  [R0805]  59.07 99.18 270 top
R5  2kΩ  [R0805]  59.07 65.28 270 top
R6  4.7kΩ  [R0805]  42.57 103.68 270 top
R7  4.7kΩ  [R0805]  42.57 69.78 270 top
R8  4.7kΩ  [R0805]  59.07 103.68 90 top
R9  4.7kΩ  [R0805]  59.07 69.78 90 top
R10  100kΩ  [R0805]  56.07 103.68 270 top
R11  100kΩ  [R0805]  56.07 69.78 270 top
R12  10kΩ  [R0402]  91.1 92.67 180 top
R13  10kΩ  [R0402]  78.3 69.97 180 top
R14  4.7kΩ  [R0805]  56.07 76.98 270 top
R15  4.7kΩ  [R0805]  56.07 41.58 270 top
R16  2kΩ  [R0805]  59.07 81.48 270 top
R17  2kΩ  [R0805]  59.07 46.09 270 top
R18  4.7kΩ  [R0805]  42.57 85.98 270 top
R19  4.7kΩ  [R0805]  42.57 50.58 270 top
R20  340Ω  [R0805]  96.74 13.16 270 top
R21  4.7kΩ  [R0805]  58.97 85.98 90 top
R22  4.7kΩ  [R0805]  59.07 50.58 90 top
R23  100kΩ  [R0805]  56.07 85.98 270 top
R24  100kΩ  [R0805]  56.07 50.58 270 top
R25  147Ω  [R0805]  89.78 26.55 270 top
R26  1kΩ  [R0805]  80.76 48.63 270 top
R27  1kΩ  [R0805]  77.86 48.63 270 top
R28  0Ω  [R0402]  79 38.17 90 top
R29  10kΩ  [R0402]  85.9 38.07 270 top
R30  10kΩ  [R0402]  95 38.17 270 top
R31  0Ω  [R0402]  88.1 38.07 90 top
R32  5.1kΩ  [R0402]  97.2 38.77 90 top
R33  5.1kΩ  [R0402]  97.2 49.17 270 top
RESET  TS-1101S-C-B-B-B-A  [SW-SMD_L6.0-W3.5-LS8.0]  100.1 53.47 180 top
RGB  XL-5050RGBC-WS2812B  [LED-SMD_4P-L5.0-W5.0-BL_XL-5050RGBC]  69 47.07 0 top
RX  SZYY0805YG  [LED0805-R-RD_GREEN]  77.86 44.13 90 top
TX  17-215SURC/S530-A2/TR8(TY)  [LED0805-RD_RED]  80.76 44.13 90 top
U1  DB128L-5.08-3P-BK-S  [CONN-TH_3P-P5.08_DB128L-5.08-3P-BK-S]  7.7 99.77 90 top
U2  DB128L-5.08-3P-BK-S  [CONN-TH_3P-P5.08_DB128L-5.08-3P-BK-S]  7.7 64.37 90 top
U3  ESP32-S3-WROOM-1(N8R8)  [WIRELM-SMD_ESP32-S3-WROOM-1]  89.7 81.26 270 top
U4  CYPC817(C-TP2)  [SOP-4_L6.4-W4.6-P2.54-LS10.2-TL]  46.92 97.68 180 top
U5  CYPC817(C-TP2)  [SOP-4_L6.4-W4.6-P2.54-LS10.2-TL]  46.92 63.78 180 top
U6  DB128L-5.08-3P-BK-S  [CONN-TH_3P-P5.08_DB128L-5.08-3P-BK-S]  7.7 82.07 90 top
U7  DB128L-5.08-3P-BK-S  [CONN-TH_3P-P5.08_DB128L-5.08-3P-BK-S]  7.7 46.67 90 top
U8  CYPC817(C-TP2)  [SOP-4_L6.4-W4.6-P2.54-LS10.2-TL]  46.92 79.98 180 top
U9  CYPC817(C-TP2)  [SOP-4_L6.4-W4.6-P2.54-LS10.2-TL]  46.92 44.58 180 top
U10  ZX-PM2.54-2-4PY  [HDR-TH_8P-P2.54-V-F-R2-C4-S2.54]  95.3 23.67 90 top
U11  ZX-PM2.54-2-4PY  [HDR-TH_8P-P2.54-V-F-R2-C4-S2.54]  88.6 12.67 0 top
U12  A2541HWV-7P  [HDR-TH_7P-P2.54-V_A2541HWV-7P]  90 99.67 180 top
U13  A2541HWV-10P  [HDR-TH_10P-P2.54-V-F-1]  86 62.67 180 top
U14  ZX-PM2.54-1-12PY  [HDR-TH_12P-P2.54-V-F]  71 80.67 270 top
U15  HB-PH3-25414PB2GOP  [HDR-TH_4P-P2.54-V-M]  101.3 23.67 90 top
U16  HB-PH3-25414PB2GOP  [HDR-TH_4P-P2.54-V-M]  88.6 6.67 0 top
U17  CP2102-GMR  [WQFN-28_L5.0-W5.0-P0.50-BL-EP3.2]  87 44.47 90 top
U18  4.7uF  [C0402]  94.4 94.77 0 top
U19  DB128L-5.08-2P-BK-S  [CONN-TH_2P-P5.08_DB128L-5.08-2P-BK-S]  7.6 17.97 90 top
U20  HLK-10M05  [PWRM-TH_HLK-10M05]  38.2 17.57 0 top
U21  AMS1117-3.3_C347222  [SOT-223-4_L6.5-W3.5-P2.30-LS7.0-BR]  67.5 13.67 270 top
U22  LTC4412HVIS6#TRPBF  [TSOT-23-6_L2.9-W1.6-P0.95-LS2.8-BR]  75 27.17 0 top
USB1  TYPE-C 16PIN 2MD(073)  [USB-C-SMD_TYPE-C-6PIN-2MD-073]  102 43.97 90 top

## Footprints (pads in the part's own frame, mm; a bottom-side part is the same pattern mirrored in y, then rotated)
C0402
  rect 0.79x0.54 smd: 1(-0.545,0) 2(0.545,0)
C0805
  rect 1.41x1.35 smd: 1(-1,0) 2(1,0)
CAP-SMD_BD6.3-L6.6-W6.6-LS7.2-FD
  rect 3.5x1.2 smd: 1(-2.67,0) 2(2.67,0)
CONN-TH_2P-P5.08_DB128L-5.08-2P-BK-S
  round 2.4 hole 1.6: 1(-2.54,0) 2(2.54,0)
CONN-TH_3P-P5.08_DB128L-5.08-3P-BK-S
  round 2.4 hole 1.6: 1(-5.08,0) 2(0,0) 3(5.08,0)
F0805
  rect 1.335x1.5 smd: 1(-1.143,0) 2(1.143,0)
HDR-TH_4P-P2.54-V-M
  rect 1.7x1.7 hole 1.1: 1(-3.81,0)
  round 1.7 hole 1.1: 2(-1.27,0) 3(1.27,0) 4(3.81,0)
HDR-TH_7P-P2.54-V_A2541HWV-7P
  rect 1.8x1.8 hole 1.2: 1(-7.62,0)
  round 1.8 hole 1.2: 2(-5.08,0) 3(-2.54,0) 4(0,0) 5(2.54,0) 6(5.08,0) 7(7.62,0)
HDR-TH_8P-P2.54-V-F-R2-C4-S2.54
  rect 1.6x1.6 hole 1.1: 1(-3.81,-1.27)
  round 1.6 hole 1.1: 2(-3.81,1.27) 3(-1.27,-1.27) 4(-1.27,1.27) 5(1.27,-1.27) 6(1.27,1.27) 7(3.81,-1.27) 8(3.81,1.27)
HDR-TH_10P-P2.54-V-F-1
  rect 1.8x1.8 hole 1.2: 1(-11.43,0)
  round 1.8 hole 1.2: 2(-8.89,0) 3(-6.35,0) 4(-3.81,0) 5(-1.27,0) 6(1.27,0) 7(3.81,0) 8(6.35,0) 9(8.89,0) 10(11.43,0)
HDR-TH_12P-P2.54-V-F
  round 1.8 hole 1.05: 1(-13.97,0) 2(-11.43,0) 3(-8.89,0) 4(-6.35,0) 5(-3.81,0) 6(-1.27,0) 7(1.27,0) 8(3.81,0) 9(6.35,0) 10(8.89,0) 11(11.43,0) 12(13.97,0)
LED0805-R-RD
  rect 1x1.399 smd: 1(1.05,0) 2(-1.05,0)
LED0805-R-RD_GREEN
  rect 1x1.399 smd: 1(1.05,0) 2(-1.05,0)
LED0805-RD_ORANGE
  rect 1x1.25 smd: 1(-1.1,0) 2(1.1,0)
LED0805-RD_RED
  rect 1x1.25 smd: 1(-1.1,0) 2(1.1,0)
LED-SMD_4P-L5.0-W5.0-BL_XL-5050RGBC
  rect 1x1.5 smd: 1(-1.5,-2.5) 2(1.5,-2.5) 3(1.5,2.5) 4(-1.5,2.5)
M2-MOUNTING-HOLE
  round 4 hole 2.2: 1(0,-0.001)
Pad_e2259
  round 0.62 hole 0.31: (0,0)
Pad_e2260
  round 0.62 hole 0.31: (0,0)
Pad_e2261
  round 0.62 hole 0.31: (0,0)
Pad_e2262
  round 0.62 hole 0.31: (0,0)
Pad_e2263
  round 0.62 hole 0.31: (0,0)
Pad_e2264
  round 0.62 hole 0.31: (0,0)
Pad_e2265
  round 0.62 hole 0.31: (0,0)
Pad_e2266
  round 0.62 hole 0.31: (0,0)
Pad_e2267
  round 0.62 hole 0.31: (0,0)
Pad_e2269
  round 0.62 hole 0.31: (0,0)
Pad_e2271
  round 0.62 hole 0.31: (0,0)
Pad_e2272
  round 0.62 hole 0.31: (0,0)
Pad_e2273
  round 0.62 hole 0.31: (0,0)
PWRM-TH_HLK-10M05
  round 1.8 hole 1.2: 1(-21.25,3.9) 2(-21.25,-3.9) 3(21.25,11.4) 4(21.25,-11.4)
R0402
  rect 0.566x0.54 smd: 1(-0.433,0) 2(0.433,0)
R0805
  rect 1.133x1.377 smd: 1(-1,0) 2(1,0)
RELAY-TH_ALQ1XX
  round 2.3 hole 1.5: 1(-8.889,-3.81) 2(1.27,-3.81) 3(8.89,-3.81) 4(6.351,3.81) 5(-8.889,3.81)
SOD-80_L3.5-W1.5-RD
  rect 1.44x1.62 smd: 1(-1.765,0) 2(1.765,0)
SOD-123_L2.7-W1.6-LS3.7-RD-1
  rect 1.2x0.95 smd: 1(-1.7,0) 2(1.7,0)
SOD-323_L1.8-W1.3-LS2.5-RD
  rect 1x0.75 smd: 1(-1.173,0) 2(1.173,0)
SOP-4_L6.4-W4.6-P2.54-LS10.2-TL
  rect 2.6x1.423 smd: 1(-4.38,1.27) 2(-4.38,-1.27) 3(4.38,-1.27) 4(4.38,1.27)
SOT-23-3_L2.9-W1.3-P1.90-LS2.4-BR
  rect 1.25x0.7 smd: 1(1,-0.95) 2(1,0.95) 3(-1,0)
SOT-23-3_L2.9-W1.6-P1.90-LS2.8-BR
  rect 1.07x0.6 smd: 1(1.235,-0.95) 2(1.235,0.95) 3(-1.235,0)
SOT-23-3_L3.0-W1.7-P0.95-LS2.9-BR
  rect 1.038x0.532 smd: 1(1.101,-0.95) 2(1.101,0.95) 3(-1.101,0)
SOT-143-4_L2.9-W1.3-P1.92-LS2.4-BL
  rect 1.194x0.838 smd: 1(-0.75,-1.191)
  rect 0.838x0.838 smd: 2(0.95,-1.191) 3(0.95,1.192) 4(-0.95,1.192)
SOT-223-4_L6.5-W3.5-P2.30-LS7.0-BR
  rect 2.47x0.98 smd: 1(2.835,-2.3) 2(2.835,0) 3(2.835,2.3)
  rect 2.47x3.6 smd: 4(-2.835,0)
SW-SMD_L6.0-W3.5-LS8.0
  rect 1.74x1.4 smd: 1(-3.67,0) 2(3.67,0)
TSOT-23-6_L2.9-W1.6-P0.95-LS2.8-BR
  rect 0.8x0.532 smd: 1(1.2,-0.95) 2(1.2,0) 3(1.2,0.95) 4(-1.2,0.95) 5(-1.2,0) 6(-1.2,-0.95)
USB-C-SMD_TYPE-C-6PIN-2MD-073
  rect 0.55x1.1 smd: 1(-3.2,2.375) 2(-2.4,2.375) 11(2.401,2.375) 12(3.2,2.375)
  rect 0.3x1.1 smd: 3(-1.75,2.375) 4(-1.25,2.375) 5(-0.75,2.375) 6(-0.25,2.375) 7(0.25,2.375) 8(0.75,2.375) 9(1.25,2.375) 10(1.75,2.375)
  oval 1.1x2 hole 0.6x1.5: 13(-4.325,1.825) 14(4.325,1.825)
  oval 1.2x1.8 hole 0.6x1.2: 15(-4.325,-2.375) 16(4.325,-2.375)
WIRELM-SMD_ESP32-S3-WROOM-1
  rect 1.5x0.9 smd: 1(-8.75,8.895) 2(-8.75,7.625) 3(-8.75,6.355) 4(-8.75,5.085) 5(-8.75,3.815) 6(-8.75,2.545) 7(-8.75,1.275) 8(-8.75,0.005) 9(-8.75,-1.265) 10(-8.75,-2.535) 11(-8.75,-3.805) 12(-8.75,-5.075) 13(-8.75,-6.345) 14(-8.75,-7.615) 27(8.75,-7.615) 28(8.75,-6.345) 29(8.75,-5.075) 30(8.75,-3.805) 31(8.75,-2.535) 32(8.75,-1.265) 33(8.75,0.005) 34(8.75,1.275) 35(8.75,2.545) 36(8.75,3.815) 37(8.75,5.085) 38(8.75,6.355) 39(8.75,7.625) 40(8.75,8.895)
  rect 0.9x1.5 smd: 15(-6.985,-8.895) 16(-5.715,-8.895) 17(-4.445,-8.895) 18(-3.175,-8.895) 19(-1.905,-8.895) 20(-0.635,-8.895) 21(0.635,-8.895) 22(1.905,-8.895) 23(3.175,-8.895) 24(4.445,-8.895) 25(5.715,-8.895) 26(6.985,-8.865)
  rect 0.9x0.9 smd: 41(-0.1,-0.225) 42(-1.5,-0.226) 43(-2.9,-0.225) 44(-2.9,2.575) 45(-1.5,2.575) 46(-0.1,2.575) 47(-0.1,1.175) 48(-2.9,1.175) 49(-1.5,1.175)
WQFN-28_L5.0-W5.0-P0.50-BL-EP3.2
  oval 0.28x0.9 smd: 1(-1.502,-2.5) 2(-1.001,-2.5) 3(-0.5,-2.5) 4(0,-2.5) 5(0.5,-2.5) 6(1,-2.5) 7(1.501,-2.5) 15(1.501,2.5) 16(1,2.5) 17(0.5,2.5) 18(0,2.5) 19(-0.5,2.5) 20(-1.001,2.5) 21(-1.502,2.5)
  oval 0.9x0.28 smd: 8(2.5,-1.502) 9(2.5,-1.001) 10(2.5,-0.5) 11(2.5,0) 12(2.5,0.5) 13(2.5,1) 14(2.5,1.501) 22(-2.5,1.501) 23(-2.5,1) 24(-2.5,0.5) 25(-2.5,0) 26(-2.5,-0.5) 27(-2.5,-1.001) 28(-2.5,-1.502)
  rect 3.2x3.2 smd: 29(0,0)

## Nets
As in the schematic, except:
3V3: C1.2 C2.2 C11.2 C12.1 NOREF. NOREF#2. NOREF#5. NOREF#11. R2.2 R3.2 R4.2 R5.2 R12.2 R13.2 R14.2 R15.2 R16.2 R17.2 R25.1 R26.1 R27.1 U3.2 U10.1 U10.3 U10.5 U10.7 U15.1 U15.2 U21.4
+5V: C9.1 C10.2 D1.1 D2.1 D3.1 D4.1 D5.1 K1.5 K2.5 K3.5 K4.5 NOREF#8. NOREF#12. NOREF#13. Q10.2 R20.1 RGB.1 U4.4 U5.4 U8.4 U9.4 U11.1 U11.3 U11.5 U11.7 U16.1 U16.2 U21.1 U22.6
GND: BOOT.1 C1.1 C2.1 C3.1 C4.1 C5.2 C6.1 C7.1 C8.1 C9.2 C10.1 C11.1 C12.2 D7.1 LED1.2 LED2.1 MH1.1 MH2.1 MH3.1 MH4.1 NOREF#6. NOREF#9. Q1.2 Q2.2 Q3.2 Q4.2 Q5.2 Q6.2 Q7.2 Q8.2 R10.1 R11.1 R23.1 R24.1 R32.1 R33.1 RESET.1 RGB.3 U3.1 U3.40 U3.41 U3.42 U3.43 U3.44 U3.45 U3.46 U3.47 U3.48 U3.49 U10.2 U10.4 U10.6 U10.8 U11.2 U11.4 U11.6 U11.8 U15.3 U15.4 U16.3 U16.4 U17.3 U18.1 U20.4 U21.3 U22.2 U22.3 USB1.1 USB1.12
GPIO4: NOREF#4. R8.2 U3.4
GPIO5: NOREF#3. R21.2 U3.5
GPIO6: NOREF#10. R9.2 U3.6
GPIO7: NOREF#7. R22.2 U3.7

Pads without a net: RGB 2; U17 1 2 9 10 11 12 13 14 15 16 17 18 19 20 21 22 23 27 29; U21 2; U22 4; USB1 3 9 13 14 15 16

## Via types
v1: diameter 0.62, hole 0.31, Top Layer to Bottom Layer, 96 vias
v2: diameter 0.61, hole 0.305, Top Layer to Bottom Layer, 86 vias

## Routing (per net, layer and track width the routed paths; a pad name or vN(x,y) marks a point on that pad's centre or on a via; arc(x,y) is an arc through that point)
3V3: length 52.1
  Top Layer w0.5: v1(90.67,93.66) 90.67,92.67 R12.2 ; R13.2 v1(76.6,69.97)
  Top Layer w0.7: 97.35,92.67 97.32,92.64 U3.2 ; 97.36,94.77 C2.2 ; C1.2 v1(97.36,95.97)
  Top Layer w1: R26.1 v2(80.76,51.07) ; 59.07,98.18 59.07,95.14 v1(58.3,94.37) 57.62,93.69 R2.2 ; v1(89.77,29.04) 89.77,27.56 R25.1 ; v1(66.48,21.29) 66.48,19.69 C11.2 66.5,17.51 U21.4 68.57,16.51 71.73,19.67 C12.1 ; R14.2 56.17,75.88 57.64,75.88 v1(58.4,76.64) 59.07,77.31 R16.2 ; R5.2 59.07,61.26 v1(58.35,60.54) 57.59,59.78 R3.2 ; R15.2 57.47,40.58 v1(58.27,41.38) 59.07,42.18 59.07,45.08 ; R27.1 v2(77.86,51.07)
  Power w1: v2(77.86,51.07) 77.87,51.07
+5V: length 88.9
  Top Layer w0.7: v1(72.48,25.65) 72.48,25.66 73.02,26.2 U22.6
  Top Layer w1: v1(38.04,59.45) 39.48,59.45 U5.4 ; v1(38.04,59.45) 38.04,62.44 D2.1 ; v1(38.04,59.45) 34.42,59.44 K2.5 ; R20.1 96.76,14.18 v1(96.76,15.82) ; 70.1,28.12 70.99,29.01 v1(71.65,29.01) 71.65,31.48 67.47,35.66 67.47,44.54 RGB.1 ; D5.1 79.46,25.43 v1(79.46,24.4) ; v1(38.07,77.16) 40.99,77.16 U8.4 ; v1(38.07,77.16) 34.41,77.15 K3.5 ; v1(38.07,77.17) D3.1 ; 34.43,94.83 K1.5 ; 69.61,5.85 71.43,7.67 ; U9.4 40.96,41.73 v1(38.09,41.73) ; U4.4 40.97,94.84 v1(38.07,94.84) ; v1(38.07,94.84) 34.43,94.84 ; v1(38.07,94.84) D1.1 ; 72.31,7.64 72.33,7.66 71.43,7.66 ; D4.1 v1(38.09,41.73) ; v1(38.09,41.73) 34.44,41.72 33.6,42.56 ; 69.61,5.86 v1(65.16,5.86) 65.16,7.63 65.19,7.66 65.2,10.83
GND: length 210.8
  Top Layer w0.254: 90.91,40.97 90.91,43.46 90.4,43.97 U17.3
  Top Layer w0.5: USB1.1 98.81,40.77 v1(98.41,40.37) v1(97.6,40.37) ; USB1.12 98.81,47.17 v1(98.41,47.57) v1(97.6,47.57) ; 97.2,38.34 v1(97.2,37.27) ; R33.1 v1(97.2,50.87)
  Top Layer w0.7: 98.45,92.67 98.59,92.52 98.59,92.53 ; 98.45,92.67 98.45,92.66 ; 98.45,92.67 v1(98.45,93.72) 98.45,94.76 ; v1(79.6,68.37) 80.3,68.37 80.9,68.97 80.9,69.92 80.95,69.97 ; C6.1 v1(91.7,49.27) C8.1 ; C7.1 v1(85.06,50.47) ; 98.59,92.38 98.59,89.88 ; U18.1 v1(93.86,93.73) C3.1 ; C4.1 91.25,40.97 ; 91.25,40.96 90.91,40.96 90.9,40.97 v1(89.9,40.97)
  Top Layer w1: v1(53.58,53.11) 53.58,52.31 Q8.2 ; v1(53.55,72.19) 53.55,71.48 Q4.2 ; Q7.2 53.63,87.76 v1(53.63,88.47) ; 98.59,72.51 98.6,72.51 v1(98.6,71.01) ; R23.1 56.05,87 v1(56.05,88.46) ; 98.59,90.01 98.5,84.87 97.79,84.16 U3.44 ; 103.77,34.47 104.77,34.47 v1(104.77,32.64) ; v1(48.85,72.17) 48.85,71.28 Q2.2 ; v1(53.6,106.07) 53.6,105.42 Q3.2 ; R11.1 v1(56.09,72.17) ; 92.28,81.36 97.8,81.37 98.59,80.58 U3.40 ; v1(56.04,106.05) 56.04,104.71 R10.1 ; C11.1 68.53,19.7 v1(68.53,21.33) ; Q5.2 49.01,87.64 v1(49.01,88.46) ; Q1.2 48.84,105.17 v1(48.84,106.09) ; C12.2 79.22,19.72 v1(82.06,19.72) ; 77.01,28.93 77.01,28.09 76.2,27.27 U22.3 77.01,28.93 ; 77.01,28.93 v1(77.01,30.46) ; R24.1 v1(56.1,53.11) ; RGB.3 v1(70.5,51.57) ; v1(89.77,18.83) 89.77,20.68 LED2.1 ; 69.8,10.84 v1(69.8,8.43) 69.05,7.68 67.19,7.67 ; Q6.2 48.82,52.05 v1(48.82,53.15) ; LED1.2 96.75,7.33 v1(96.75,5.13) ; v1(80.94,7.64) 77.7,7.64 C9.2 ; v1(96.3,47.37) 96.3,45.71 D7.1 ; v1(104.81,55.37) 104.8,53.47 RESET.1
  GND w1: v1(96.3,47.37) 96.3,47.47
  Bottom Layer w2: v2(48.9,108.4) 46.27,111.03 MH2.1 ; v2(59.3,1.9) 6.5,1.9 4.43,3.97 MH4.1
  vias: v2(37.2,91.9) v2(37.2,12.9) v2(38,74.5) v2(38.2,55.8) v2(38.3,112.9) v2(38.3,108.2) v2(38.82,20.8) v2(39.2,37.9) v2(39.4,33.7) v2(40.45,25.5) v2(42.07,29.15) v2(42.9,56.2) v2(43.2,108.3) v2(43.2,91.9) v2(43.69,7.8) v2(45.32,11.9) v2(46.94,6.1) v2(48.56,18.9) v2(48.9,56.1) v2(49.1,38.4) v2(49.6,91.9) v2(49.6,74.6) v2(50.18,29.1) v2(50.6,33.5) v2(51.81,25.1) v2(52,108.3) v2(53.43,7.3) v2(55.05,11.9) v2(56.68,17) v2(57.5,108.4) v2(57.8,91.3) v2(57.8,56.4) v2(58.3,22.7) v2(58.5,38.3) v2(60.2,33.3) v2(60.4,74.2) v2(62.5,67.1) v2(62.7,45.5) v2(63.1,60.7) v2(63.2,78.5) v2(64,39) v2(64.7,84.5) v2(65.2,108.5) v2(65.2,99.9) v2(65.2,72.9) v2(65.5,2.5) v2(66.2,32.3) v2(70,59) v2(70.9,39.3) v2(72,2) v2(72.9,108.6) v2(73.1,49.9) v2(74.3,100.7) v2(75,57) v2(75.7,33.5) v2(78,1.2) v2(78.9,95.9) v2(80,92) v2(80,12) v2(80.2,108.4) v2(82,56) v2(84,105) v2(84.5,34) v2(84.7,26.8) v2(84.9,21.4) v2(88.5,108.4) v2(90.7,1.6) v2(90.8,112.4) v2(91,55) v2(91,51) v2(94,105) v2(95,67) v2(97.3,112.6) v2(97.5,108.3) v2(100.7,13.2) v2(101.3,9.3) v2(103,15.5) v2(104,107) v2(104,50) v2(104,37) v2(104,30) v2(104.8,9)
VBUS: length 27.9
  Top Layer w0.5: 99.62,46.37 98.3,46.37 ; USB1.2 98.3,41.57
  Top Layer w1: 97,41.56 97,41.56 ; 97,41.56 97,42.71 ; 97,41.56 96.99,41.57 v1(95.1,41.57) ; 97,41.57 98.3,41.57 ; v1(95.1,31.77) D6.2 ; v1(97.5,46.37) 98.3,46.37 ; D7.4 97,42.73
  Bottom Layer w1: 97.5,46.37 95.08,46.37 v1(95.1,41.57) v1(95.1,31.77)
VDDUSB: length 41.6
  Top Layer w0.254: U17.7 90.1,45.97 90.3,46.17 90.3,46.37 ; 88.5,46.97 88.5,47.67
  Top Layer w0.7: v1(93.6,46.47) 91.75,46.47 C6.2 91.65,46.47 90.5,46.47 90.1,46.87 90.1,47.67 89.9,47.87 88.56,47.87 C8.2 C7.2
  Top Layer w1: D5.2 79.5,30.87 80.4,31.77 v1(87.8,31.77) D6.1
  Bottom Layer w1: v1(87.8,31.77) 93.6,36.91 v1(93.6,46.47)
CC1: length 11.8
  Top Layer w0.254: R32.2 98.47,39.2 98.6,39.07 98.6,38.47 98.8,38.27 101.7,38.27 102.2,38.77 102.2,41.57 101.5,42.27 100.85,42.27 100.4,42.72 USB1.4
CC2: length 11.1
  Top Layer w0.254: R33.2 98.47,48.74 98.5,48.77 98.5,49.07 98.9,49.47 101.7,49.47 102,49.17 102,45.87 101.85,45.72 USB1.10
D2_2: length 21.1
  Top Layer w0.254: K2.1 37.3,67.88 38.08,67.11 D2.2 39.12,65.98 39.33,66.18 39.33,71.78 39.72,72.18 44.42,72.18 45.84,70.77 45.84,69.78
D3_2: length 20.1
  Top Layer w0.254: Q5.3 45.84,87.07 44.42,88.48 39.72,88.48 39.32,88.08 39.32,83.68 39.12,83.48 38.29,83.48 D3.2 38.08,84.81 37.3,85.58 K3.1
D+: length 22.3
  Top Layer w0.254: v1(102.8,45.37) 102.36,45.37 102.02,45.02 101.72,45.02 101.37,44.67 100.35,44.67 100.3,44.72 USB1.8 ; v1(104.1,44.07) 104.1,43.87 103.9,43.67 100.35,43.67 100.3,43.72 USB1.6 95.55,43.72 95.14,43.31 95.14,42.79 D7.3 95.14,42.77 93.96,42.77 93.96,43.22 92.71,44.47 U17.4
  Bottom Layer w0.254: v1(102.8,45.37) 103.55,45.37 104.1,44.82 v1(104.1,44.07)
D-: length 22.3
  Top Layer w0.254: 99.69,43.2 USB1.5 100.3,43.22 100.35,43.27 103.81,43.27 103.9,43.18 103.9,42.87 v1(103.7,42.67) ; v1(103,44.27) 102.36,44.27 102.02,44.62 101.89,44.62 101.54,44.27 100.35,44.27 100.3,44.22 USB1.7 95.42,44.22 95.15,44.49 D7.2 94.39,45.16 94.21,44.98 94.21,44.48 93.46,44.48 92.97,44.97 U17.5
  Bottom Layer w0.254: v1(103,44.27) 103,43.29 103.62,42.67 v1(103.7,42.67)
ENABLE: length 82.5
  Top Layer w0.254: v1(96.1,87.17) 96.05,87.22 96.05,90 ; v1(93.8,53.47) RESET.2 ; v1(79.1,41.07) 79.1,38.7 R28.2
  Top Layer w0.7: 96.05,91.55 96.05,90 ; 94.95,94.77 C3.2 96.05,91.56 92.64,91.56 R12.1
  Bottom Layer w0.254: v1(96.1,87.17) 96.8,86.47 96.8,70.17 99.1,67.87 99.1,59.17 96.6,56.67 93.8,56.67 v1(93.8,53.47) 81.8,53.47 79.1,50.77 v1(79.1,41.07)
GPIO0: length 69.3
  Top Layer w0.254: U3.27 82.04,72.47 ; BOOT.2 88.9,34.47 87,36.37 87,38.47 87.1,38.57 88.03,38.57 R31.2 89.37,38.5 v1(89.4,38.47) ; 82.04,71.18 C5.1 ; 82.04,71.18 82.04,72.46 ; 82.04,71.18 78.81,71.18 78.7,71.07 78.7,70 R13.1 ; C5.1 82.04,69.96 ; C5.1 82.1,69.92 82.1,68.27 78.4,64.57 78.4,54.97 76,52.57 v1(76,38.47)
  Bottom Layer w0.254: v1(76,38.47) v1(89.4,38.47)
GPIO1: length 9.9
  Top Layer w0.254: U3.39 97.43,72.41 U13.1
GPIO2: length 10.3
  Top Layer w0.254: U13.2 96.05,63.83 U3.38
GPIO3: length 12.5
  Top Layer w0.254: U3.15 77.39,88.25 U14.1
GPIO4: length 51.4
  Top Layer w0.254: v1(61.7,104.67) 61.69,104.68 R8.2 ; v1(94.8,88.87) 94.8,90 U3.4
  Bottom Layer w0.254: v1(61.7,104.67) 76.36,104.67 77.38,103.65 77.38,89.97 78.48,88.87 v1(94.8,88.87)
GPIO5: length 53.8
  Top Layer w0.254: v1(61.82,87.48) 58.97,87.48 ; v1(93.5,88.07) 93.5,90 93.51,90.01
  Bottom Layer w0.254: v1(61.82,87.48) 64.68,90.34 64.68,97.84 75.37,97.84 75.86,97.35 75.86,89.48 77.26,88.08 v1(93.5,88.07)
GPIO6: length 59.6
  Top Layer w0.254: v1(61.82,70.78) R9.2 ; U3.6 92.2,89.97 v1(92.2,87.17)
  Bottom Layer w0.254: 92.2,87.17 74.86,87.17 73.19,85.5 73.19,65.74 71.92,64.47 69.24,64.47 62.94,70.77 v1(61.82,70.78)
GPIO7: length 62.4
  Top Layer w0.254: 90.97,90.01 91,89.99 v1(91,86.07) ; 59.07,51.57 59.08,51.58 v1(61.82,51.58)
  Bottom Layer w0.254: 91,86.07 90.95,86.02 75.45,86.02 74.03,84.61 74.03,65.76 62.05,53.78 62.05,51.81 v1(61.82,51.58)
GPIO8: length 10.8
  Top Layer w0.254: U12.5 87.46,98.23 84.62,95.39 U3.12
GPIO9: length 11.4
  Top Layer w0.254: U14.3 74.85,85.71 U3.17
GPIO10: length 10.9
  Top Layer w0.254: U3.18 73.58,84.44 71,87.02
GPIO11: length 10.3
  Top Layer w0.254: U3.19 72.31,83.17 U14.5
GPIO12: length 9.8
  Top Layer w0.254: U14.6 71.04,81.9 U3.20
GPIO13: length 10.3
  Top Layer w0.254: U14.7 72.23,80.63 U3.21
GPIO14: length 10.8
  Top Layer w0.254: U3.22 73.5,79.36 U14.8
GPIO15: length 13.8
  Top Layer w0.254: U12.1 97.62,98.19 v1(97.3,97.87) ; v1(89.7,91.77) 89.7,90.02 U3.8
  Bottom Layer w0.254: v1(97.3,97.87) 95.8,97.87 v1(89.7,91.77)
GPIO16: length 13.3
  Top Layer w0.254: U12.2 95.08,97.75 94.9,97.57 93.5,97.57 88.4,92.47 88.4,90.05 88.43,90.01
GPIO17: length 11.9
  Top Layer w0.254: U3.10 87.16,92.83 92.54,98.21 U12.3
GPIO18: length 11.4
  Top Layer w0.254: U3.11 85.89,93.47 90,97.57 U12.4
GPIO19: length 10.3
  Top Layer w0.254: 83.35,90.01 83.35,96.12 84.92,97.69 U12.6
GPIO20: length 9.8
  Top Layer w0.254: U12.7 82.38,90.31 U3.14
GPIO21: length 11.4
  Top Layer w0.254: U3.23 74.77,78.09 U14.9
GPIO35: length 33.8
  Top Layer w0.254: v1(75,66.57) 74.57,66.14 U13.10 74.6,62.64 74.6,60.17 67.5,53.07 RGB.4 ; v1(83.4,71.17) 83.4,72.47 83.35,72.51
  Bottom Layer w0.254: v1(75,66.57) 82.2,66.57 83.4,67.77 v1(83.4,71.17)
GPIO36: length 16.2
  Top Layer w0.254: U13.9 77.11,65.08 v1(77.8,65.77) ; v1(84.6,70.77) 84.6,72.49 U3.29
  Bottom Layer w0.254: v1(84.6,70.77) 84.6,67.07 83.3,65.77 v1(77.8,65.77)
GPIO37: length 14.1
  Top Layer w0.254: U13.8 79.7,62.72 79.7,64.57 82.8,67.67 85.7,67.67 85.89,67.86 U3.30
GPIO38: length 11.9
  Top Layer w0.254: U13.7 87.16,67.64 U3.31
GPIO39: length 11.4
  Top Layer w0.254: 88.43,72.51 88.43,66.38 U13.6
GPIO40: length 10.9
  Top Layer w0.254: U3.33 89.7,65.11 U13.5
GPIO41: length 10.3
  Top Layer w0.254: U13.4 90.97,63.83 90.97,72.51
GPIO42: length 9.9
  Top Layer w0.254: U3.35 92.35,72.41 U13.3
GPIO45: length 13
  Top Layer w0.254: U3.26 78.58,74.28 U14.12
GPIO46: length 11.9
  Top Layer w0.254: U3.16 76.12,86.98 71,92.1
GPIO47: length 11.9
  Top Layer w0.254: U3.24 76.04,76.82 U14.10
GPIO48: length 12.4
  Top Layer w0.254: U14.11 77.31,75.55 U3.25
GREEN1_1: length 4.9
  Top Layer w0.254: R5.1 57.92,66.28 57.62,65.98 57.62,64.28 57.52,64.18 56.12,64.18 GREEN1.1
GREEN1_2: length 10.4
  Top Layer w0.254: GREEN1.2 52.58,66.33 U5.2 51.3,67 50.34,67.97 Q4.3
GREEN2_1: length 4.9
  Top Layer w0.254: R16.1 57.82,82.48 57.62,82.28 57.62,80.48 57.52,80.38 56.12,80.38 GREEN2.1
GREEN2_2: length 10.4
  Top Layer w0.254: 50.34,85.98 50.32,84.18 51.3,83.2 U8.2 52.58,82.53 GREEN2.2
K1_1: length 19.5
  Top Layer w0.254: 33.6,103.28 37.3,103.28 38.07,102.51 D1.2 ; Q1.3 45.84,104.67 44.42,106.08 39.72,106.08 39.32,105.68 39.32,101.68 39.04,101.4 38.07,101.4
K1_2: length 17.2
  Bottom Layer w2: 23.44,103.28 19.93,99.77 U1.2
K1_3: length 8.8
  Bottom Layer w2: 15.82,103.28 14.25,104.85 U1.3
K1_4: length 11.1
  Bottom Layer w2: K1.4 17.39,94.69 U1.1
K2_2: length 17.2
  Bottom Layer w2: U2.2 19.93,64.37 K2.2
K2_3: length 8.8
  Bottom Layer w2: U2.3 14.25,69.45 K2.3
K2_4: length 11.1
  Bottom Layer w2: U2.1 17.39,59.29 K2.4
K3_2: length 17.2
  Bottom Layer w2: K3.2 19.93,82.07 U6.2
K3_3: length 8.8
  Bottom Layer w2: U6.3 14.25,87.15 15.82,85.58
K3_4: length 11.1
  Bottom Layer w2: U6.1 17.39,76.99 18.36,77.96
K4_1: length 20.2
  Top Layer w0.254: K4.1 37.3,50.18 38.08,49.41 ; 38.19,48.18 39.12,48.18 39.42,48.48 39.42,52.78 39.82,53.18 44.62,53.18 45.84,51.97 Q6.3 ; 38.08,49.39 38.08,48.29 38.19,48.17
K4_2: length 17.2
  Bottom Layer w2: U7.2 19.93,46.67 K4.2
K4_3: length 8.8
  Bottom Layer w2: K4.3 14.25,51.75 U7.3
K4_4: length 11.1
  Bottom Layer w2: U7.1 17.39,41.59 K4.4
LED2_2: length 2.7
  Top Layer w0.254: R25.2 89.74,25.51 LED2.2
Q1_1: length 9.3
  Top Layer w0.254: R6.1 42.67,104.58 44.02,104.58 44.82,103.78 44.82,102.28 45.72,101.38 48.31,101.4 48.31,102.73
Q3_1: length 6.3
  Top Layer w0.254: R8.1 R10.2 52.86,102.68 Q3.1
Q6_1: length 9.6
  Top Layer w0.254: Q6.1 48.31,48.2 45.72,48.18 44.92,48.98 44.92,50.68 44.02,51.58 R19.1
Q8_1: length 6.3
  Top Layer w0.254: R22.1 R24.2 52.86,49.58 Q8.1
Q9_1: length 3
  Top Layer w0.254: R29.2 85.57,37.64 84.5,36.57 83.45,36.57 Q9.1
Q9_3: length 2.5
  Top Layer w0.254: 79,37.74 79.17,37.57 Q9.3
Q11_1: length 3
  Top Layer w0.254: Q11.1 92.55,36.67 93.6,36.67 94.67,37.74 R30.2
Q11_3: length 2.4
  Top Layer w0.254: Q11.3 88.17,37.57 R31.1
R3_1: length 5.1
  Top Layer w0.254: R3.1 54.52,61.78 53.82,62.48 51.33,62.48 U5.1
R4_1: length 4.9
  Top Layer w0.254: 56.07,98.13 56.12,98.08 57.62,98.08 57.72,98.18 57.72,99.98 57.92,100.18 R4.1
R7_1: length 9.2
  Top Layer w0.254: R7.1 42.67,70.68 43.93,70.68 44.82,69.78 44.82,68.28 45.53,67.58 48.31,67.6 48.31,68.83
R7_2: length 3.7
  Top Layer w0.254: 42.54,68.74 42.54,65.04 ; R7.2 42.54,68.75
R11_2: length 6.3
  Top Layer w0.254: Q4.1 52.86,68.78 R11.2 R9.1
R14_1: length 5.1
  Top Layer w0.254: U8.1 51.33,78.68 53.82,78.68 54.52,77.98 R14.1
R17_1: length 4.9
  Top Layer w0.254: R17.1 57.83,47.09 57.62,46.88 57.62,45.18 57.42,44.98 56.13,44.98 GREEN3.1
R18_1: length 9.5
  Top Layer w0.254: R18.1 42.67,86.88 44.02,86.88 44.92,85.98 44.92,84.38 45.72,83.59 48.31,83.6 48.31,85.03
R18_2: length 3.7
  Top Layer w0.254: U8.3 42.54,84.95 R18.2
R20_2: length 2.7
  Top Layer w0.254: R20.2 96.7,12.12 LED1.1
R23_2: length 6.2
  Top Layer w0.254: R21.1 R23.2 52.86,84.98 Q7.1
RX_1: length 2.5
  Top Layer w0.254: R27.2 RX.1
TX_2: length 2.4
  Top Layer w0.254: 80.76,47.63 TX.2
U4_1: length 5.1
  Top Layer w0.254: R2.1 54.52,95.68 53.82,96.38 51.33,96.38 U4.1
U4_2: length 10.4
  Top Layer w0.254: Q3.3 50.34,101.48 51.3,100.52 U4.2 52.58,100.23 56.07,100.23
U4_3: length 3.7
  Top Layer w0.254: R6.2 42.54,102.65 U4.3
U9_1: length 5.1
  Top Layer w0.254: R15.1 54.52,42.58 53.72,43.38 51.37,43.38 U9.1
U9_2: length 10.4
  Top Layer w0.254: U9.2 52.59,47.14 GREEN3.2 ; Q8.3 50.34,48.57 51.3,47.61 51.3,45.86
U9_3: length 3.7
  Top Layer w0.254: U9.3 42.54,49.55 R19.2
U17_6: length 4.6
  Top Layer w0.254: v1(90.67,45.57) 90.57,45.47 U17.6 ; v1(91.8,43.67) C4.2
  Bottom Layer w0.254: v1(91.8,43.67) 91.8,44.44 v1(90.67,45.57)
U19_1: length 10
  Bottom Layer w2: 7.7,15.43 15.19,15.43 U20.2
U19_2: length 9.6
  Bottom Layer w2: 7.7,20.51 15.99,20.51 U20.1
U20_3: length 5.1
  Top Layer w1: U20.3 59.51,28.91 F1.1
U22_1: length 17.8
  Top Layer w0.7: F1.2 65.04,27.17 Q10.3 67.9,24.52 68.43,23.99 76.59,23.99 76.9,24.3 76.9,25.52 U22.1
U22_5: length 4.1
  Top Layer w0.7: U22.5 71.05,27.17 70.1,26.22
UORXD: length 52.9
  Top Layer w0.254: 93.51,72.51 93.5,72.5 v1(93.5,70.67) ; v1(91.1,57.87) 90.31,57.87 83.41,50.97 v1(83.41,39.97) ; U17.26 87.5,40.47 v1(87.7,40.27) ; RX.2 77.86,40.01 v1(77.9,39.97)
  Bottom Layer w0.254: v1(91.1,57.87) 91.1,69.58 92.19,70.67 ; 92.21,70.67 92.19,70.67 ; 92.21,70.67 92.21,70.67 v1(93.5,70.67) ; 92.21,70.67 92.2,70.67 92.19,70.67 ; 92.19,70.67 92.11,70.67 ; v1(87.7,40.27) 87.4,39.97 v1(83.41,39.97) v1(77.9,39.97)
UOTXD: length 48.6
  Top Layer w0.254: v1(80.8,40.97) 80.76,41.01 TX.1 ; 94.8,70.67 U3.37 ; U17.25 87,41.07 v1(86.6,40.67) ; v1(82.5,52.27) 89.6,59.37 v1(93.6,59.37)
  Bottom Layer w0.254: v1(80.8,40.97) 82.16,40.97 ; 82.16,40.97 82.5,41.31 v1(82.5,52.27) ; 82.16,40.97 82.46,40.67 v1(86.6,40.67) ; v1(94.8,70.67) 93.6,69.47 v1(93.6,59.37)
USB_DTR: length 10.8
  Top Layer w0.254: 88.5,41.96 88.5,39.46 ; 88.5,39.46 86,39.46 ; 88.5,39.46 92.3,39.46 ; 86,39.47 85.9,39.37 R29.1 ; 92.3,39.47 92.5,39.27 Q11.2
USB_RTS: length 17.6
  Top Layer w0.254: R30.1 95,39.57 94.5,40.07 v1(91.6,40.07) ; Q9.2 84.25,38.52 84.5,38.77 84.5,39.07 v1(84.8,39.37) 84.9,39.47 84.9,41.07 86.1,41.07 86.5,41.47 86.5,41.97
  Bottom Layer w0.254: v1(84.8,39.37) 90.9,39.37 v1(91.6,40.07)

## Copper pours and planes (outline as drawn; the poured copper is in the pictures)
3V3 on Power: 106.8,17.77 80.5,17.77 80.5,14.77 64,14.77 64,22.67 81.7,22.57 81.7,35.87 52.9,35.87 52.9,116.27 106.8,116.27 106.8,85.17 88.48,85.17 88.48,80.45 106.8,80.45
+5V on Power: 35.47,32.55 35.47,116.24 44.82,116.24 44.87,36.15 44.87,34.85 80.77,34.85 80.76,23.36 72.02,23.38 63.26,23.36 63.19,23.29 63.17,13.45 65.97,13.45 65.97,5.65 70.17,5.65 70.27,5.75 70.27,8.35 70.17,8.45 74.57,8.45 74.57,3.25 74.47,3.15 82.57,3.15 82.6,16.82 98.65,16.73 98.55,-0.33 61.97,-0.33 61.97,32.45 61.87,32.55
GND on Top Layer: 88.6,85.07 93.1,85.07 93.1,80.57 88.6,80.57
GND on GND: 106.8,-0.33 35.43,-0.33 35.43,116.27 106.8,116.27

## Text on the board
Top Silkscreen Layer: (Naren Subburaj) | GPIO48 | GPIO45 | GPIO47 | GPIO03 | GPIO46 | GPIO09 | GPIO14 | GPIO10 | GPIO12 | GPIO21 | GPIO13 | GPIO11 | GND | 5V | GPIO35 | GPIO36 | GPIO37 | GPIO38 | GPIO20 | GPIO39 | GPIO19 | GPIO40 | GPIO08 | GPIO41 | GPIO18 | GPIO42 | GPIO17 | GPIO2 | GPIO16 | GPI01 | GPIO15 | 3V3 | ESP32-S3-WROOM-1(N8R8) | L | N | RELAY1 - GPIO4 | RELAY2 - GPIO5 | RELAY3 - GPIO6 | RELAY4 - GPIO7 | v1.0 | designed by | RESET | BOOT | RGB LED | RXD | TXD | N0 | NC | COM | AC INPUT | ESP32 RELAY BOARD
